# Altium project Printer.PrjPcb (part 1 of 2)
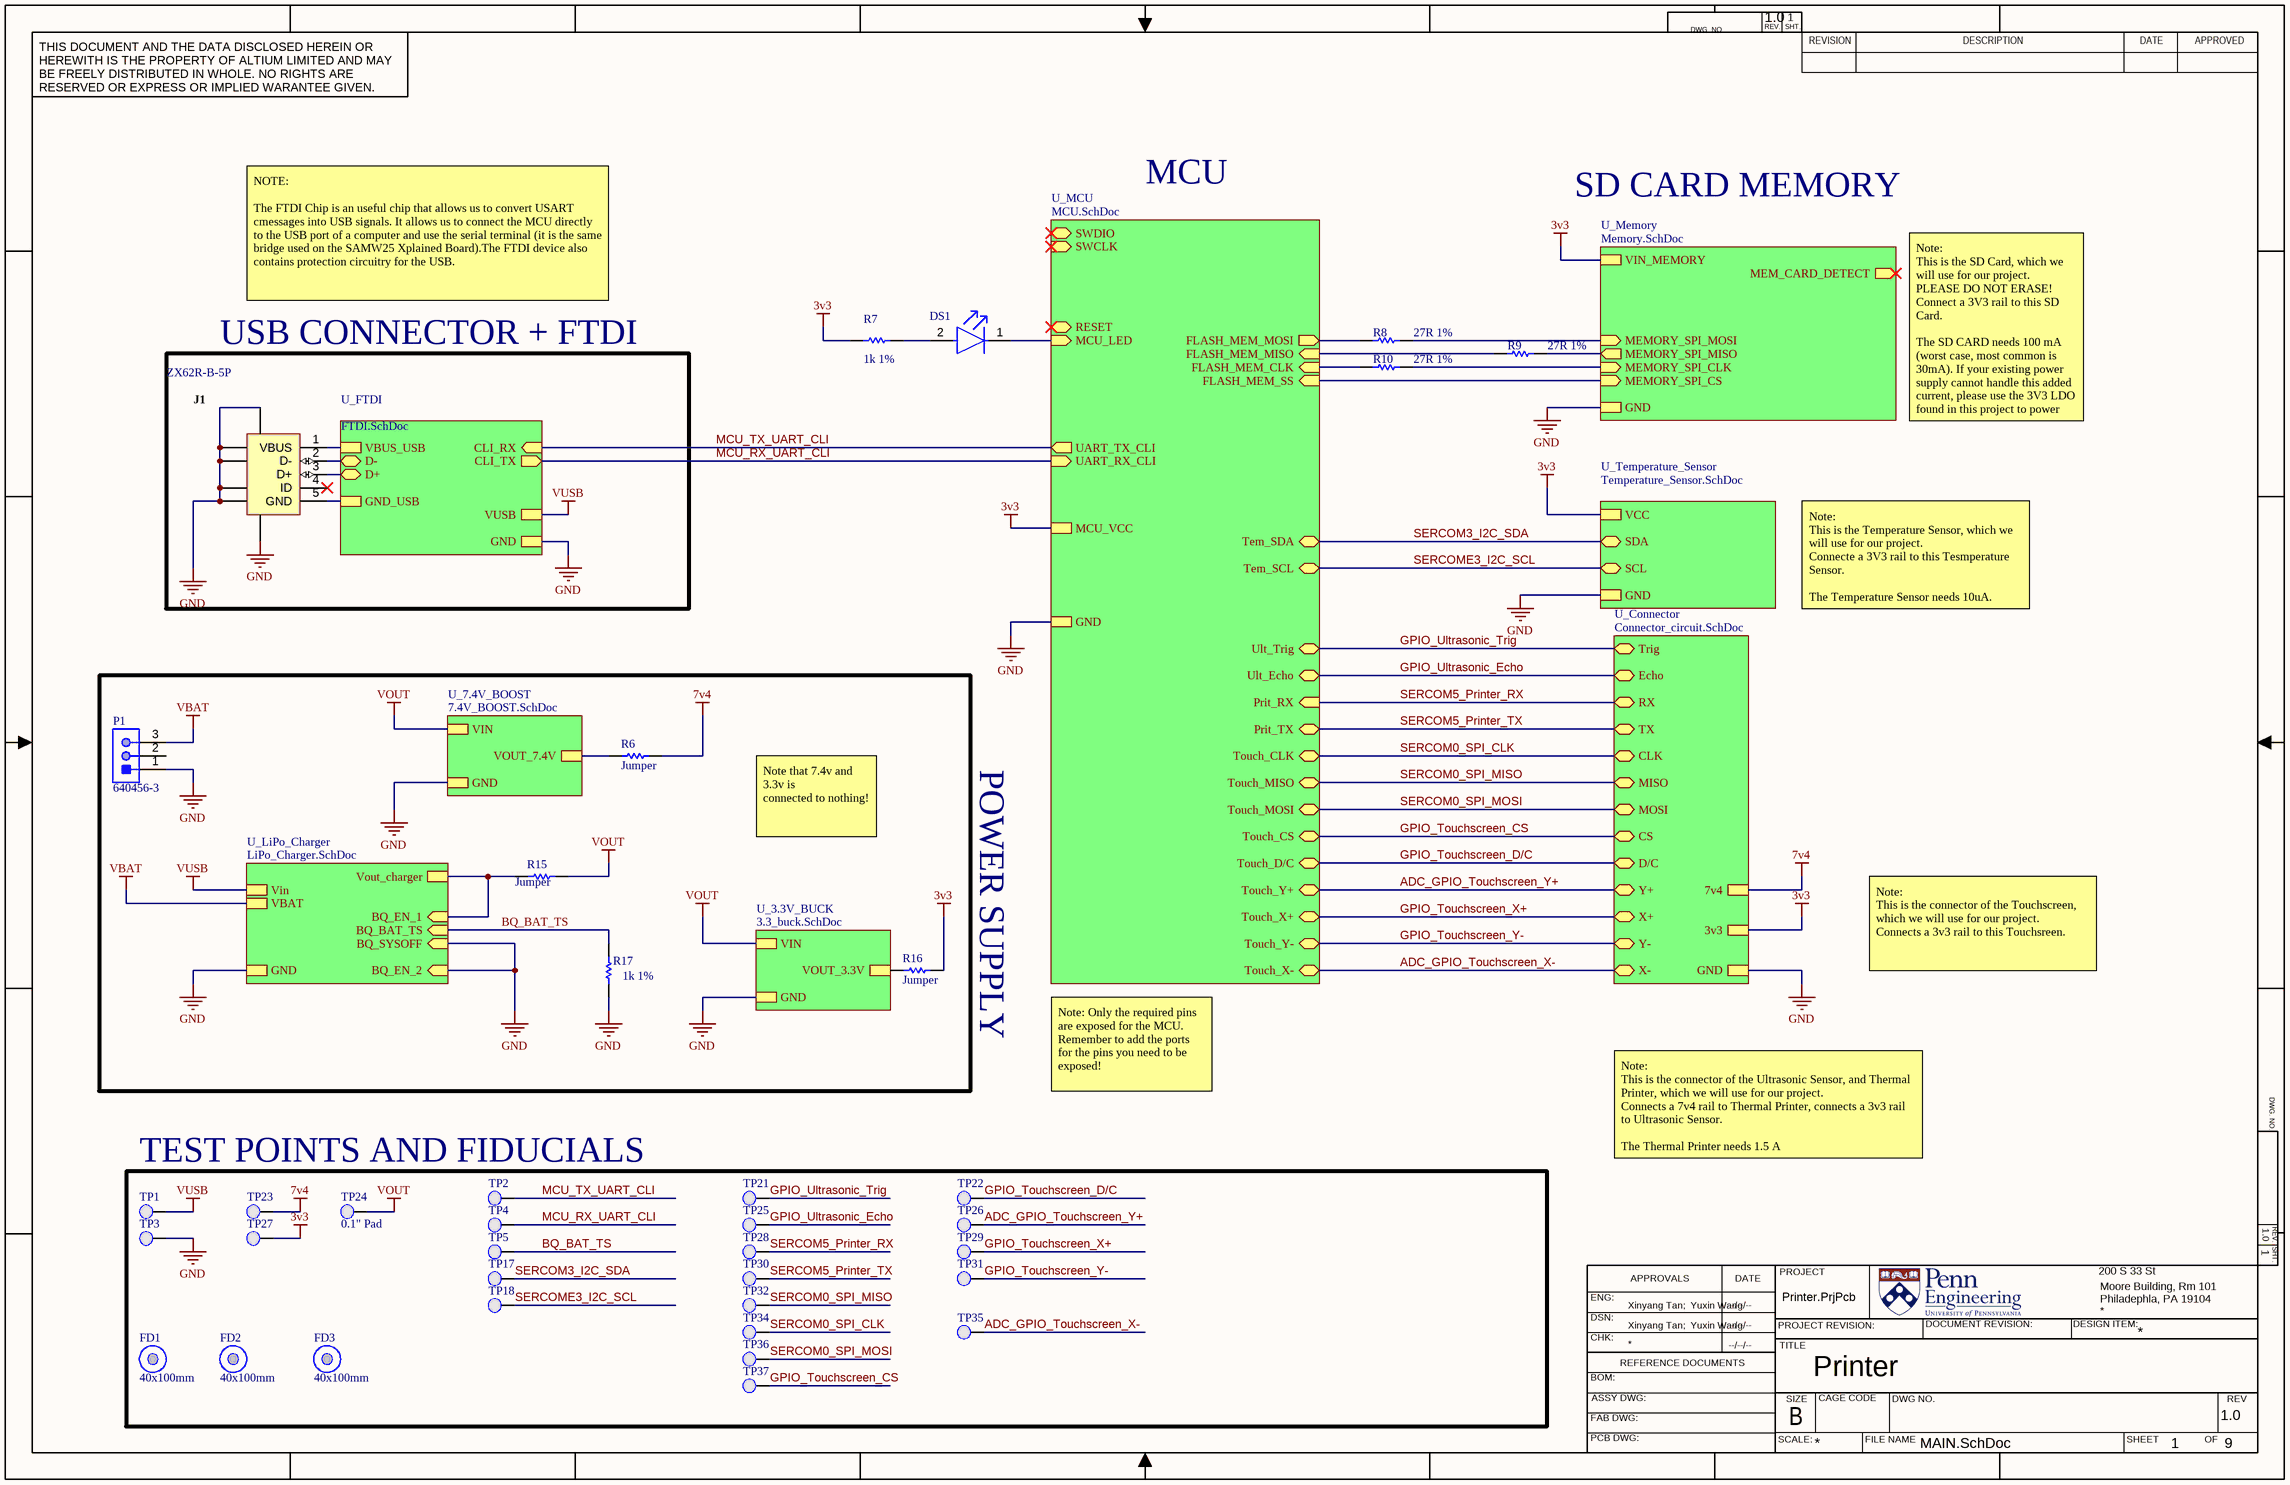
[diagram p0: MAIN.SchDoc]
9 sheets, 151 parts. Net scope: strictly hierarchical (ports join the sheet entries above them; power ports are local).
Board file: Printer.PcbDoc
Sheets:
  MAIN.SchDoc
    U_FTDI = FTDI.SchDoc
    U_MCU = MCU.SchDoc
    U_Memory = Memory.SchDoc
    U_Temperature_Sensor = Temperature_Sensor.SchDoc
    U_Connector = Connector_circuit.SchDoc
    U_LiPo_Charger = LiPo_Charger.SchDoc
    U_7.4V_BOOST = 7.4v_BOOST.schdoc
    U_3.3V_BUCK = 3.3_buck.schdoc

## Sheet MAIN.SchDoc: Printer
size 431 x 279 mm; Date: 2022; Author: Renaissance; CompanyName: Upenn-ESE516; DrawnBy: Xinyang Tan;  Yuxin Wang; Engineer: Xinyang Tan;  Yuxin Wang; Address1: 200 S 33 St; Address2: Moore Building, Rm 101; Address3: Philadephla, PA 19104; DocumentNumber: 1; Revision: 1.0; SheetNumber: 1; SheetTotal: 9; Project: Printer.PrjPcb; ENG_APP_DATE: --/--/--; DSN_APP_DATE: --/--/--; CHK_APP_DATE: --/--/--; Time: 03/02

### Parts
DS1  LTST-C191KGKT  [FP-LTST-C191KGKT-MFG]  (value not drawn)
FD1  40x100mm  [Fiducial_FT]  (no BOM)
FD2  40x100mm  [Fiducial_FT]  (no BOM)
FD3  40x100mm  [Fiducial_FT]  (no BOM)
J1  ZX62R-B-5P  [HIRO-ZX62R-B-5P_V]
P1  640456-3  [TECO-640456-3]
R6  Jumper  [RESC1609X50X30LL10T20]
R7  1k 1%  [RESC1609X50X30NL10T20]
R8  27R 1%  [RESC0603(1608)_N]
R9  27R 1%  [RESC0603(1608)_N]
R10  27R 1%  [RESC0603(1608)_N]
R15  Jumper  [RESC1609X50X30LL10T20]
R16  Jumper  [RESC1609X50X30LL10T20]
R17  1k 1%  [RESC0603(1608)_N]
TP1  0.1" Pad  [PCBComponent]  (value not drawn)
TP2  0.1" Pad  [PCBComponent]  (value not drawn)
TP3  0.1" Pad  [PCBComponent]  (value not drawn)
TP4  0.1" Pad  [PCBComponent]  (value not drawn)
TP5  0.1" Pad  [PCBComponent]  (value not drawn)
TP17  0.1" Pad  [PCBComponent]  (value not drawn)
TP18  0.1" Pad  [PCBComponent]  (value not drawn)
TP21  0.1" Pad  [PCBComponent]  (value not drawn)
TP22  0.1" Pad  [PCBComponent]  (value not drawn)
TP23  0.1" Pad  [PCBComponent]  (value not drawn)
TP24  0.1" Pad  [PCBComponent]
TP25  0.1" Pad  [PCBComponent]  (value not drawn)
TP26  0.1" Pad  [PCBComponent]  (value not drawn)
TP27  0.1" Pad  [PCBComponent]  (value not drawn)
TP28  0.1" Pad  [PCBComponent]  (value not drawn)
TP29  0.1" Pad  [PCBComponent]  (value not drawn)
TP30  0.1" Pad  [PCBComponent]  (value not drawn)
TP31  0.1" Pad  [PCBComponent]  (value not drawn)
TP32  0.1" Pad  [PCBComponent]  (value not drawn)
TP34  0.1" Pad  [PCBComponent]  (value not drawn)
TP35  0.1" Pad  [PCBComponent]  (value not drawn)
TP36  0.1" Pad  [PCBComponent]  (value not drawn)
TP37  0.1" Pad  [PCBComponent]  (value not drawn)

### Blocks framed on the sheet
USB CONNECTOR + FTDI: J1
TEST POINTS AND FIDUCIALS: FD1-FD3 TP1-TP5 TP17 TP18 TP21-TP32 TP34-TP37

### Sub-sheets
U_3.3V_BUCK = 3.3_buck.SchDoc: VIN, GND, VOUT_3.3V
U_7.4V_BOOST = 7.4V_BOOST.SchDoc: VIN, GND, VOUT_7.4V
U_Connector = Connector_circuit.SchDoc: CLK (bidir), MISO (bidir), MOSI (bidir), CS (bidir), D/C (bidir), Y+ (bidir), X+ (bidir), Y- (bidir), X- (bidir), 7v4, 3v3, GND, Trig (bidir), Echo (bidir), RX (bidir), TX (bidir)
U_FTDI = FTDI.SchDoc: CLI_RX (in), CLI_TX (out), VUSB, GND, VBUS_USB, D- (bidir), D+ (bidir), GND_USB
U_LiPo_Charger = LiPo_Charger.SchDoc: Vin, VBAT, GND, Vout_charger, BQ_EN_1 (in), BQ_BAT_TS (in), BQ_SYSOFF (in), BQ_EN_2 (in)
U_MCU = MCU.SchDoc: SWDIO (bidir), SWCLK (in), UART_TX_CLI (out), UART_RX_CLI (in), FLASH_MEM_SS (in), FLASH_MEM_CLK (in), FLASH_MEM_MISO (in), FLASH_MEM_MOSI (out), RESET (bidir), MCU_LED (in), MCU_VCC, GND, Tem_SDA (bidir), Tem_SCL (bidir), Ult_Trig (bidir), Ult_Echo (bidir), Prit_RX (in), Prit_TX (bidir), Touch_CLK (bidir), Touch_MISO (bidir), Touch_MOSI (bidir), Touch_CS (bidir), Touch_D/C (bidir), Touch_Y+ (bidir), Touch_X+ (bidir), Touch_Y- (bidir), Touch_X- (bidir)
U_Memory = Memory.SchDoc: MEMORY_SPI_MOSI (in), MEMORY_SPI_MISO (out), MEMORY_SPI_CLK (in), MEMORY_SPI_CS (in), MEM_CARD_DETECT (out), VIN_MEMORY, GND
U_Temperature_Sensor = Temperature_Sensor.SchDoc: VCC, SDA (bidir), SCL (bidir), GND

### Nets
3v3: R7.1 R16.2 TP27.1(PAD) ; sheet U_MCU/MCU_VCC, sheet U_Memory/VIN_MEMORY, sheet U_Temperature_Sensor/VCC, sheet U_Connector/3v3
7v4: R6.2 TP23.1(PAD) ; sheet U_Connector/7v4
GND: J1.5(GND) J1.6(SHLD) J1.7(SHLD) J1.8(SHLD) J1.9(SHLD) J1.10(SHLD) J1.11(SHLD) P1.1 R17.1 TP3.1(PAD) ; sheet U_FTDI/GND, sheet U_FTDI/GND_USB, sheet U_MCU/GND, sheet U_Memory/GND, sheet U_Temperature_Sensor/GND, sheet U_Connector/GND, sheet U_LiPo_Charger/GND, sheet U_LiPo_Charger/BQ_SYSOFF, sheet U_LiPo_Charger/BQ_EN_2, sheet U_7.4V_BOOST/GND, sheet U_3.3V_BUCK/GND
VBAT: P1.3 ; sheet U_LiPo_Charger/VBAT
VBUS: J1.1(VBUS) ; sheet U_FTDI/VBUS_USB
VOUT: R15.2 TP24.1(PAD) ; sheet U_7.4V_BOOST/VIN, sheet U_3.3V_BUCK/VIN
Vout_BQ: R15.1 ; sheet U_LiPo_Charger/Vout_charger, sheet U_LiPo_Charger/BQ_EN_1
VUSB: TP1.1(PAD) ; sheet U_FTDI/VUSB, sheet U_LiPo_Charger/Vin
ADC_GPIO_Touchscreen_X-: TP35.1(PAD) ; sheet U_MCU/Touch_X-, sheet U_Connector/X-
ADC_GPIO_Touchscreen_Y+: TP26.1(PAD) ; sheet U_MCU/Touch_Y+, sheet U_Connector/Y+
BQ_BAT_TS: R17.2 TP5.1(PAD) ; sheet U_LiPo_Charger/BQ_BAT_TS
FLASH_MEM_SPI_SS: sheet U_MCU/FLASH_MEM_SS, sheet U_Memory/MEMORY_SPI_CS
GPIO_Touchscreen_CS: TP37.1(PAD) ; sheet U_MCU/Touch_CS, sheet U_Connector/CS
GPIO_Touchscreen_D/C: TP22.1(PAD) ; sheet U_MCU/Touch_D/C, sheet U_Connector/D/C
GPIO_Touchscreen_X+: TP29.1(PAD) ; sheet U_MCU/Touch_X+, sheet U_Connector/X+
GPIO_Touchscreen_Y-: TP31.1(PAD) ; sheet U_MCU/Touch_Y-, sheet U_Connector/Y-
GPIO_Ultrasonic_Echo: TP25.1(PAD) ; sheet U_MCU/Ult_Echo, sheet U_Connector/Echo
GPIO_Ultrasonic_Trig: TP21.1(PAD) ; sheet U_MCU/Ult_Trig, sheet U_Connector/Trig
MCU_LED: DS1.1(C) ; sheet U_MCU/MCU_LED
MCU_RX_UART_CLI: TP4.1(PAD) ; sheet U_FTDI/CLI_TX, sheet U_MCU/UART_RX_CLI
MCU_TX_UART_CLI: TP2.1(PAD) ; sheet U_FTDI/CLI_RX, sheet U_MCU/UART_TX_CLI
MEM_SPI_CLK: R10.2 ; sheet U_Memory/MEMORY_SPI_CLK
MEM_SPI_MISO: R9.2 ; sheet U_Memory/MEMORY_SPI_MISO
MEM_SPI_MOSI: R8.2 ; sheet U_Memory/MEMORY_SPI_MOSI
SERCOM0_SPI_CLK: TP34.1(PAD) ; sheet U_MCU/Touch_CLK, sheet U_Connector/CLK
SERCOM0_SPI_MISO: TP32.1(PAD) ; sheet U_MCU/Touch_MISO, sheet U_Connector/MISO
SERCOM0_SPI_MOSI: TP36.1(PAD) ; sheet U_MCU/Touch_MOSI, sheet U_Connector/MOSI
SERCOM1_PAD2_SPI_MISO: R9.1 ; sheet U_MCU/FLASH_MEM_MISO
SERCOM1_PAD2_SPI_MOSI: R8.1 ; sheet U_MCU/FLASH_MEM_MOSI
SERCOM1_PAD3_SPI_SCK: R10.1 ; sheet U_MCU/FLASH_MEM_CLK
SERCOM3_I2C_SDA: TP17.1(PAD) ; sheet U_MCU/Tem_SDA, sheet U_Temperature_Sensor/SDA
SERCOM5_Printer_RX: TP28.1(PAD) ; sheet U_MCU/Prit_RX, sheet U_Connector/RX
SERCOM5_Printer_TX: TP30.1(PAD) ; sheet U_MCU/Prit_TX, sheet U_Connector/TX
SERCOME3_I2C_SCL: TP18.1(PAD) ; sheet U_MCU/Tem_SCL, sheet U_Temperature_Sensor/SCL
USB_DATA_N: J1.2(D-) ; sheet U_FTDI/D-
USB_DATA_P: J1.3(D+) ; sheet U_FTDI/D+
VOUT_3.3V: R16.1 ; sheet U_3.3V_BUCK/VOUT_3.3V
VOUT_7.4V: R6.1 ; sheet U_7.4V_BOOST/VOUT_7.4V
NetDS1_2: DS1.2(A) R7.2

Not connected (* = marked no-connect by the designer): J1 4(ID)*; P1 2

### Notes on the sheet
- MCU
- SD CARD MEMORY
- NOTE:
  The FTDI Chip is an useful chip that allows us to convert USART cmessages into USB signals. It allows us to connect the MCU directly to the USB port of a computer and use the serial terminal (it is the same bridge used on the SAMW25 Xplained Board).The FTDI device also contains protection circuitry for the USB.
- Note:
  This is the SD Card, which we will use for our project. PLEASE DO NOT ERASE! Connect a 3V3 rail to this SD Card.
  The SD CARD needs 100 mA (worst case, most common is 30mA). If your existing power supply cannot handle this added current, please use the 3V3 LDO found in this project to power your SD Card.
- Note:
  This is the Temperature Sensor, which we will use for our project.
  Connecte a 3V3 rail to this Tesmperature Sensor.
  The Temperature Sensor needs 10uA.
- (near R16) POWER SUPPLY
- Note that 7.4v and 3.3v is
  connected to nothing!
- Note:
  This is the connector of the Touchscreen, which we will use for our project.
  Connects a 3v3 rail to this Touchsreen.
- Note: Only the required pins are exposed for the MCU. Remember to add the ports for the pins you need to be exposed!
- Note:
  This is the connector of the Ultrasonic Sensor, and Thermal Printer, which we will use for our project.
  Connects a 7v4 rail to Thermal Printer, connects a 3v3 rail to Ultrasonic Sensor.
  The Thermal Printer needs 1.5 A
- DWG. NO.
- REV.
- SHT.
- THIS DOCUMENT AND THE DATA DISCLOSED HEREIN OR HEREWITH IS THE PROPERTY OF ALTIUM LIMITED AND MAY BE FREELY DISTRIBUTED IN WHOLE. NO RIGHTS ARE RESERVED OR EXPRESS OR IMPLIED WARANTEE GIVEN.
- REVISION
- DESCRIPTION
- DATE
- APPROVED
- ENG:
- APPROVALS
- PROJECT
- DSN:
- CHK:
- REFERENCE DOCUMENTS
- PROJECT REVISION:
- TITLE
- DOCUMENT REVISION:
- DESIGN ITEM:
- BOM:
- FAB DWG:
- PCB DWG:
- ASSY DWG:
- SCALE:
- SIZE
- B
- CAGE CODE
- FILE NAME
- DWG NO.
- SHEET
- OF
- REV

### Library data of the parts
DS1 = CMP-2000-05198-2: LED GREEN CLEAR SMD; Forward Voltage: 2V; Number of Elements: 1; Viewing Angle: 130°; Forward Current: 30mA; Luminous Intensity: 35mcd; Reverse Voltage: 5V; Power Dissipation: 75mW; Lens Color: Colorless; Dominant Wavelength: 571nm; Lens Style: Rectangular; Test Current: 20mA; Wavelength: 574nm; Packaging: Tape and Reel; Width: 0.8mm; Case Code (Imperial): 0603; Number of Pins: 2; Max Power Dissipation: 75mW; Lead Free: Lead Free; Package Quantity: 1; Min Operating Temperature: -55°C; Case/Package: 0603; Length: 1.6mm; Depth: 0.8mm; Radiation Hardening: No; Mount: Surface Mount; Max Operating Temperature: 85°C; Color: Green; Power Rating: 75mW; Height: 0.55mm; Number of LEDs: 1; Illumination Color: Green; Case Code (Metric): 1608; Lens Transparency: Clear
FD1-FD3 = CMP-00174-A.4: Fiducial 40x100mm
J1 = CMP-0031-00001-1: Connector; USBMicro-B,Reverse type, SMT; 5 Position; Right Angle; DatasheetVersion: 08/2010; Operating Temperature: -30 to 85 degC; Mounting Technology: Surface Mount; PartNumber: ZX62R-B-5P; PackageReference: ZX62R-B-5P; ComponentLink2URL: http://www.hirose.co.jp/cataloge_hp/e24200011.pdf; ComponentLink1URL: http://www.hirose.com/â€Ž; ComponentLink2Description: Datasheet; PackageDescription: 5-Pin USB Micro-B R/A Connector; ComponentLink1Description: Manufacturer URL
P1 = CMP-2000-05418-1: Male Header, Pitch 2.54 mm, 1 x 3 Position, Height 10.03 mm, Tail Length 3.56 mm, -55 to 105 degC; Manufacturer: TE Connectivity; Agency Approvals: CSA,UL; Angle: Straight; Number of Positions: 3; Standards: RoHSCompliant,ELVCompliant,UL94V-0; Current, Rating: 5 / A; Connector Type: MTA-100; Mount Angle: Vertical; Material, Housing: Polyester; Temperature, Operating: -55to+105 / degC; Voltage, Rating: 250 / V; Color, Housing: White; Contact Centerline Spacing: 0.100 / in.; Special Features: Pinstrip; Material, Contact: CopperAlloy; Contact Termination Area Plating: Tin; Primary Type: InterconnectSystem; Pin Spacing: 0.1 / "; Brand/Series: MTA-100Series; Mounting Hole Size: 0.04 / "; Manufacturer URL: http://www.te.com/; Datasheet URL: https://datasheet.ciiva.com/16456/eng-ds-82056-mta-0608-16456886.pdf; Flammability Rating: UL94V-0; Mounting Type: PCMount; Contact Mating Area Plating: Tin; Datasheet Version: Jun-08; Number of Rows: 1; Termination: Solder; Type: PCBPlug; Length, Pin: 0.14 / "; Color: White; Contact Plating: Tin; Contact Shape: Square; Number of Contacts: 3; Size, Post: 0.025 / in.; Length, Terminal Post: 0.14 / in.; Length, Overall: 0.3 / "
R6 R15 R16 = CMP-1012-00001-2: Manufacturer: Vishay Dale; Part Number: CRCW06030000Z0EC
R7 = CMP-1012-00510-2: Manufacturer: Vishay Dale; Part Number: CRCW06031K00FKEB
R8-R10 = CMP-1012-00331-1: 27R 0.1W 1% 0603 (1608 Metric)  SMD; Case-EIA: 0603; Value: 27.00 Ohm; Case-Metric: 1608; Technology: SMT; Tolerance: 1 %; Power: 0.1 W
R17 = CMP-1012-00001-1: Jumper 0603 (1608 Metric); Case-Metric: 1608; Value: 0.00 Ohm; Power: None; Case-EIA: 0603; Technology: SMT; Tolerance: None
TP1-TP5 TP17 TP18 TP21-TP32 TP34-TP37 = 0.1" Pad-A.4

## Sheet FTDI.SchDoc: Printer
size 431 x 279 mm; Date: 2022; Author: Renaissance; CompanyName: Upenn-ESE516; DrawnBy: Xinyang Tan;  Yuxin Wang; Engineer: Xinyang Tan;  Yuxin Wang; Address1: 200 S 33 St; Address2: Moore Building, Rm 101; Address3: Philadephla, PA 19104; DocumentNumber: 2; Revision: 1.0; SheetNumber: 2; SheetTotal: 9; Time: 03/02
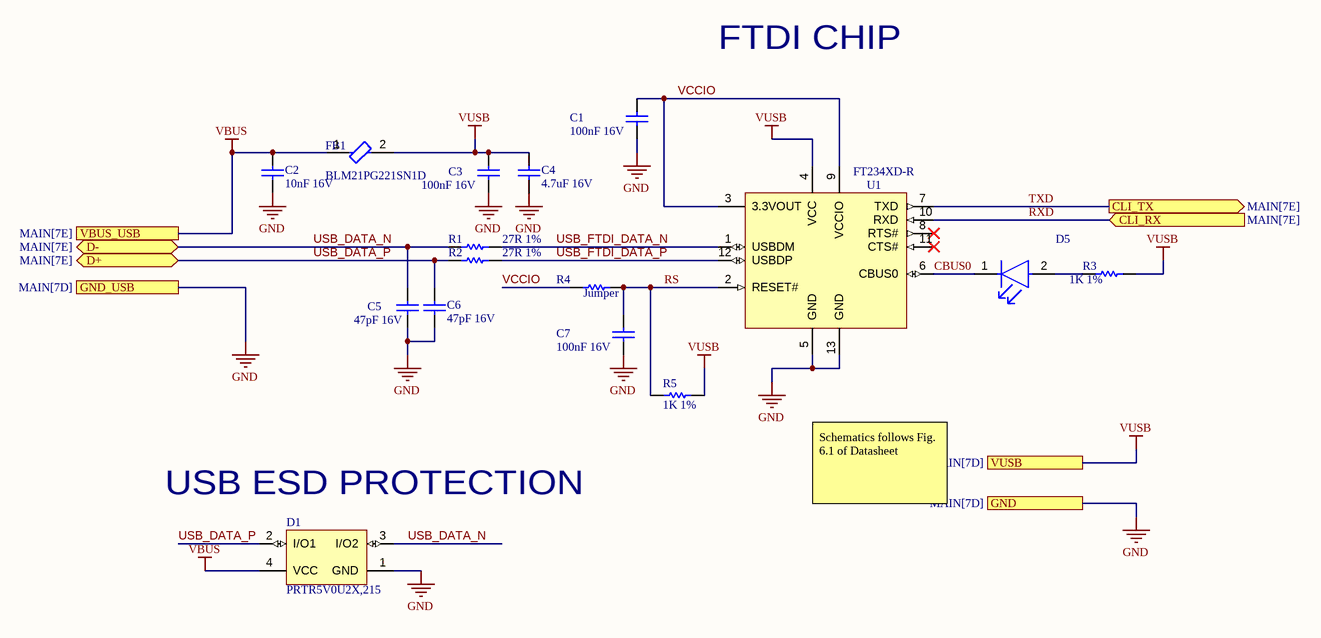
[diagram p1: FTDI.SchDoc]

### Parts
C1  100nF 16V  [CAPC1608X95X40NL15T15]
C2  10nF 16V  [CAPC1608X87X35ML15T15]
C3  100nF 16V  [CAPC1608X95X40NL15T15]
C4  4.7uF 16V  [CAPC0805(2012)145_N]
C5  47pF 16V  [CAPC0603(1608)100_N]
C6  47pF 16V  [CAPC0603(1608)100_N]
C7  100nF 16V  [CAPC1608X95X40NL15T15]
D1  PRTR5V0U2X,215  [NXP-SOT143B-4_V]
D5  LTST-C170CKT  [FP-LTST-C170CKT-MFG]  (value not drawn)
FB1  BLM21PG221SN1D  [FP-BLM21-0_2-t0_85-e0_5-IPC_B]
R1  27R 1%  [RESC0603(1608)_N]
R2  27R 1%  [RESC0603(1608)_N]
R3  1K 1%  [RESC1609X50X30NL10T20]
R4  Jumper  [RESC1609X50X30LL10T20]
R5  1K 1%  [RESC1609X50X30NL10T20]
U1  FT234XD-R  [DFN-12_V]

### Ports
CLI_RX (in, see MAIN[7E]), CLI_TX (out, see MAIN[7E]), D+ (bidir, see MAIN[7E]), D- (bidir, see MAIN[7E]), GND (see MAIN[7D]), GND_USB (see MAIN[7D]), VBUS_USB (see MAIN[7E]), VUSB (see MAIN[7D])

### Nets
GND: C1.1 C2.1 C3.1 C4.1 C5.1 C6.1 C7.1 D1.1(GND) U1.5(GND) U1.13(GND) ; port GND, port GND_USB
VBUS: C2.2 D1.4(VCC) FB1.1 ; port VBUS_USB
VUSB: C3.2 C4.2 FB1.2 R3.2 R5.1 U1.4(VCC) ; port VUSB
CBUS0: D5.1(C) U1.6(CBUS0)  [project net CBUS0_2]
RS: C7.2 R4.2 R5.2 U1.2(RESET#)  [project net RS_2]
RXD: U1.10(RXD) ; port CLI_RX  [project net MCU_TX_UART_CLI]
TXD: U1.7(TXD) ; port CLI_TX  [project net MCU_RX_UART_CLI]
USB_DATA_N: C5.2 D1.3(I/O2) R1.1 ; port D-
USB_DATA_P: C6.2 D1.2(I/O1) R2.1 ; port D+
USB_FTDI_DATA_N: R1.2 U1.1(USBDM)  [project net USB_FTDI_DATA_N_2]
USB_FTDI_DATA_P: R2.2 U1.12(USBDP)  [project net USB_FTDI_DATA_P_2]
VCCIO: C1.2 R4.1 U1.3(3.3VOUT) U1.9(VCCIO)  [project net VCCIO_2]
NetD5_2: D5.2(A) R3.1

Not connected (* = marked no-connect by the designer): U1 8(RTS#)* 11(CTS#)*

### Notes on the sheet
- FTDI CHIP
- (near D1) USB ESD PROTECTION
- Schematics follows Fig. 6.1 of Datasheet
- DWG. NO.
- REV.
- SHT.
- THIS DOCUMENT AND THE DATA DISCLOSED HEREIN OR HEREWITH IS THE PROPERTY OF ALTIUM LIMITED AND MAY BE FREELY DISTRIBUTED IN WHOLE. NO RIGHTS ARE RESERVED OR EXPRESS OR IMPLIED WARANTEE GIVEN.
- REVISION
- DESCRIPTION
- DATE
- APPROVED
- ENG:
- APPROVALS
- PROJECT
- DSN:
- CHK:
- REFERENCE DOCUMENTS
- PROJECT REVISION:
- TITLE
- DOCUMENT REVISION:
- DESIGN ITEM:
- BOM:
- FAB DWG:
- PCB DWG:
- ASSY DWG:
- SCALE:
- SIZE
- B
- CAGE CODE
- FILE NAME
- DWG NO.
- SHEET
- OF
- REV

### Library data of the parts
C1 C3 C7 = CMP-1035-02584-2: Manufacturer: Vitramon; Part Number: VJ0603Y104KXJCW1BC
C2 = CMP-1035-02311-2: Part Number: C0603C103K4RACTU; Manufacturer: Kemet
C4 = CMP-1036-04893-1: CAP 4.7uF 16V -20% to +80% 0805 (2012 Metric) Thickness 1.45mm SMD; Case-Metric: 2012; Case-EIA: 0805; Max Thickness: 1.45 mm; Value: 4.7uF; Rated Voltage: 16 V; Tolerance: -20% to +80%; Technology: SMT
C5 C6 = CMP-1035-01048-1: CAP 47pF 16V ±0.5pF 0603 (1608 Metric) Thickness 1mm SMD; Case-EIA: 0603; Case-Metric: 1608; Tolerance: Â±0.5pF; Technology: SMT; Value: 47pF; Rated Voltage: 16 V; Max Thickness: 1 mm
D1 = CMP-2000-05285-1: Ultra Low Capacitance Double Rail-to-Rail ESD Protection Diode, 5.5 V, 1 pF, -40 to 85 degC, 4-Pin SOT143B, RoHS, Tape and Reel; Manufacturer: NXP Semiconductors; Capacitance Value: 16pF; Number of Elements: 1; Rad Hardened: No; Reverse Breakdown Voltage: 6V; Working Voltage (Max): 5.5V; Polarity: Uni-Directional; Configuration: Quad; Leakage Current: 0.1uA; Product Height (mm): 1mm; Suppressor Type: DiodeArrays; Product Length (mm): 3mm; Product Depth (mm): 1.4mm; ESD Protection Voltage: 8KV@ContactDisc; Package Type: SOT; Mounting: SurfaceMount; Packaging: TapeandReel; Datasheet Version: Rev. 02, 01/2008; Reverse Stand-off Voltage: 5.5V; Manufacturer URL: http://www.nxp.com/; Operating Temp Range: -40Cto85C; Operating Temperature Classification: Industrial; Working Voltage: 5.5V; Operating Temperature Min Deg. C: -40C; Datasheet URL: https://datasheet.ciiva.com/4479/prtr5v0u2x-102853-4479461.pdf; Leakage Current (Max): 0.1uA; Direction Type: Uni-Directional; Pin Count: 3+Tab; Operating Temperature Max Deg. C: 85C; Mounting Style: SurfaceMount; Package / Case: SOT
D5 = CMP-1674-00001-6: LED RED CLEAR SMD; Number of Elements: 1; Power Dissipation: 100mW; Lens Color: Colorless; Voltage: 5V; Wavelength: 660nm; Viewing Angle: 130°; Forward Current: 40mA; Luminous Intensity: 10mcd; Forward Voltage: 1.8V; Test Current: 10mA; Dominant Wavelength: 638nm; Lens Style: Diffused; Package Quantity: 1; Packaging: Tape and Reel; Max Operating Temperature: 85°C; Min Operating Temperature: -55°C; Mount: Surface Mount; Length: 2mm; Height: 1.1mm; Case/Package: 0805; Radiation Hardening: No; Illumination Color: Red; Max Power Dissipation: 100mW; Reverse Voltage: 5V; Lead Free: Lead Free; Color: Red; Case Code (Imperial): 0805; Case Code (Metric): 2012; Power Rating: 100mW; Lens Transparency: Clear; Number of LEDs: 1; Number of Pins: 2; Depth: 1.25mm; Width: 1.25mm
FB1 = CMP-0686-00610-3: Chip Ferrite Bead, 0805, 220Ω @ 100MHz, 0.045Ω, 25%, 2A; Number of Circuits: 1; Shielding: Unshielded; DC Resistance (DCR): 45mR; Impedance: 220R; Radiation Hardening: No; Material: Ferrite; Frequency: 100MHz; Width: 1.25mm; DC Current: 2A; Max DC Current: 2A; Number of Lines: 1; Package Quantity: 1; Case Code (Metric): 2012; Current Rating: 2A; Case/Package: 0805; Current: 2A; Military Standard: Not; Core Material: Ferrite; Depth: 1.25mm; Contact Plating: Tin; DC Resistance-Max: 45mR; Max Operating Temperature: 125°C; Length: 2mm; Max Current Rating: 2A; REACH SVHC: No SVHC; Termination: SMD/SMT; Min Operating Temperature: -55°C; Series: BLM21P; Test Frequency: 100MHz; Tolerance: 25%; Number of Pins: 2; RoHS Compliant: Yes; Height: 0.85mm; Packaging: Tape and Reel; Lead Free: Lead Free; Case Code (Imperial): 0805
R1 R2 = CMP-1012-00331-1: as R8 on sheet MAIN; Technology: SMT; Tolerance: 1 %; Power: 0.1 W
R3 R5 = CMP-1012-00510-2: as R7 on sheet MAIN
R4 = CMP-1012-00001-2: as R6 on sheet MAIN
U1 = CMP-0248-00027-1: FT234XD USB to BASIC UART IC, -40 to +85 degC, 12-Pin DFN, Pb-Free, Tape and Reel; Manufacturer: FTDI; PackageReference: DFN-12; PackageVersion: Feb-13; DatasheetVersion: ver 1.1, Feb-2013; ComponentLink1URL: http://www.ftdichip.com/; PartNumber: FT234XD-R; ComponentLink2URL: http://www.ftdichip.com/Support/Documents/DataSheets/ICs/DS_FT234XD.pdf; ComponentLink1Description: Manufacturer URL; PackageDescription: 12-Pin Dual Flat No-Lead, 3 x 3 mm Body, 0.45 mm Pitch, Exposed Pad; ComponentLink2Description: Datasheet

## Sheet MCU.SchDoc: Printer
size 431 x 279 mm; Date: 2022; Author: Renaissance; CompanyName: Upenn-ESE516; DrawnBy: Xinyang Tan;  Yuxin Wang; Engineer: Xinyang Tan;  Yuxin Wang; Address1: 200 S 33 St; Address2: Moore Building, Rm 101; Address3: Philadephla, PA 19104; DocumentNumber: 7; Revision: 1.0; SheetNumber: 7; SheetTotal: 9
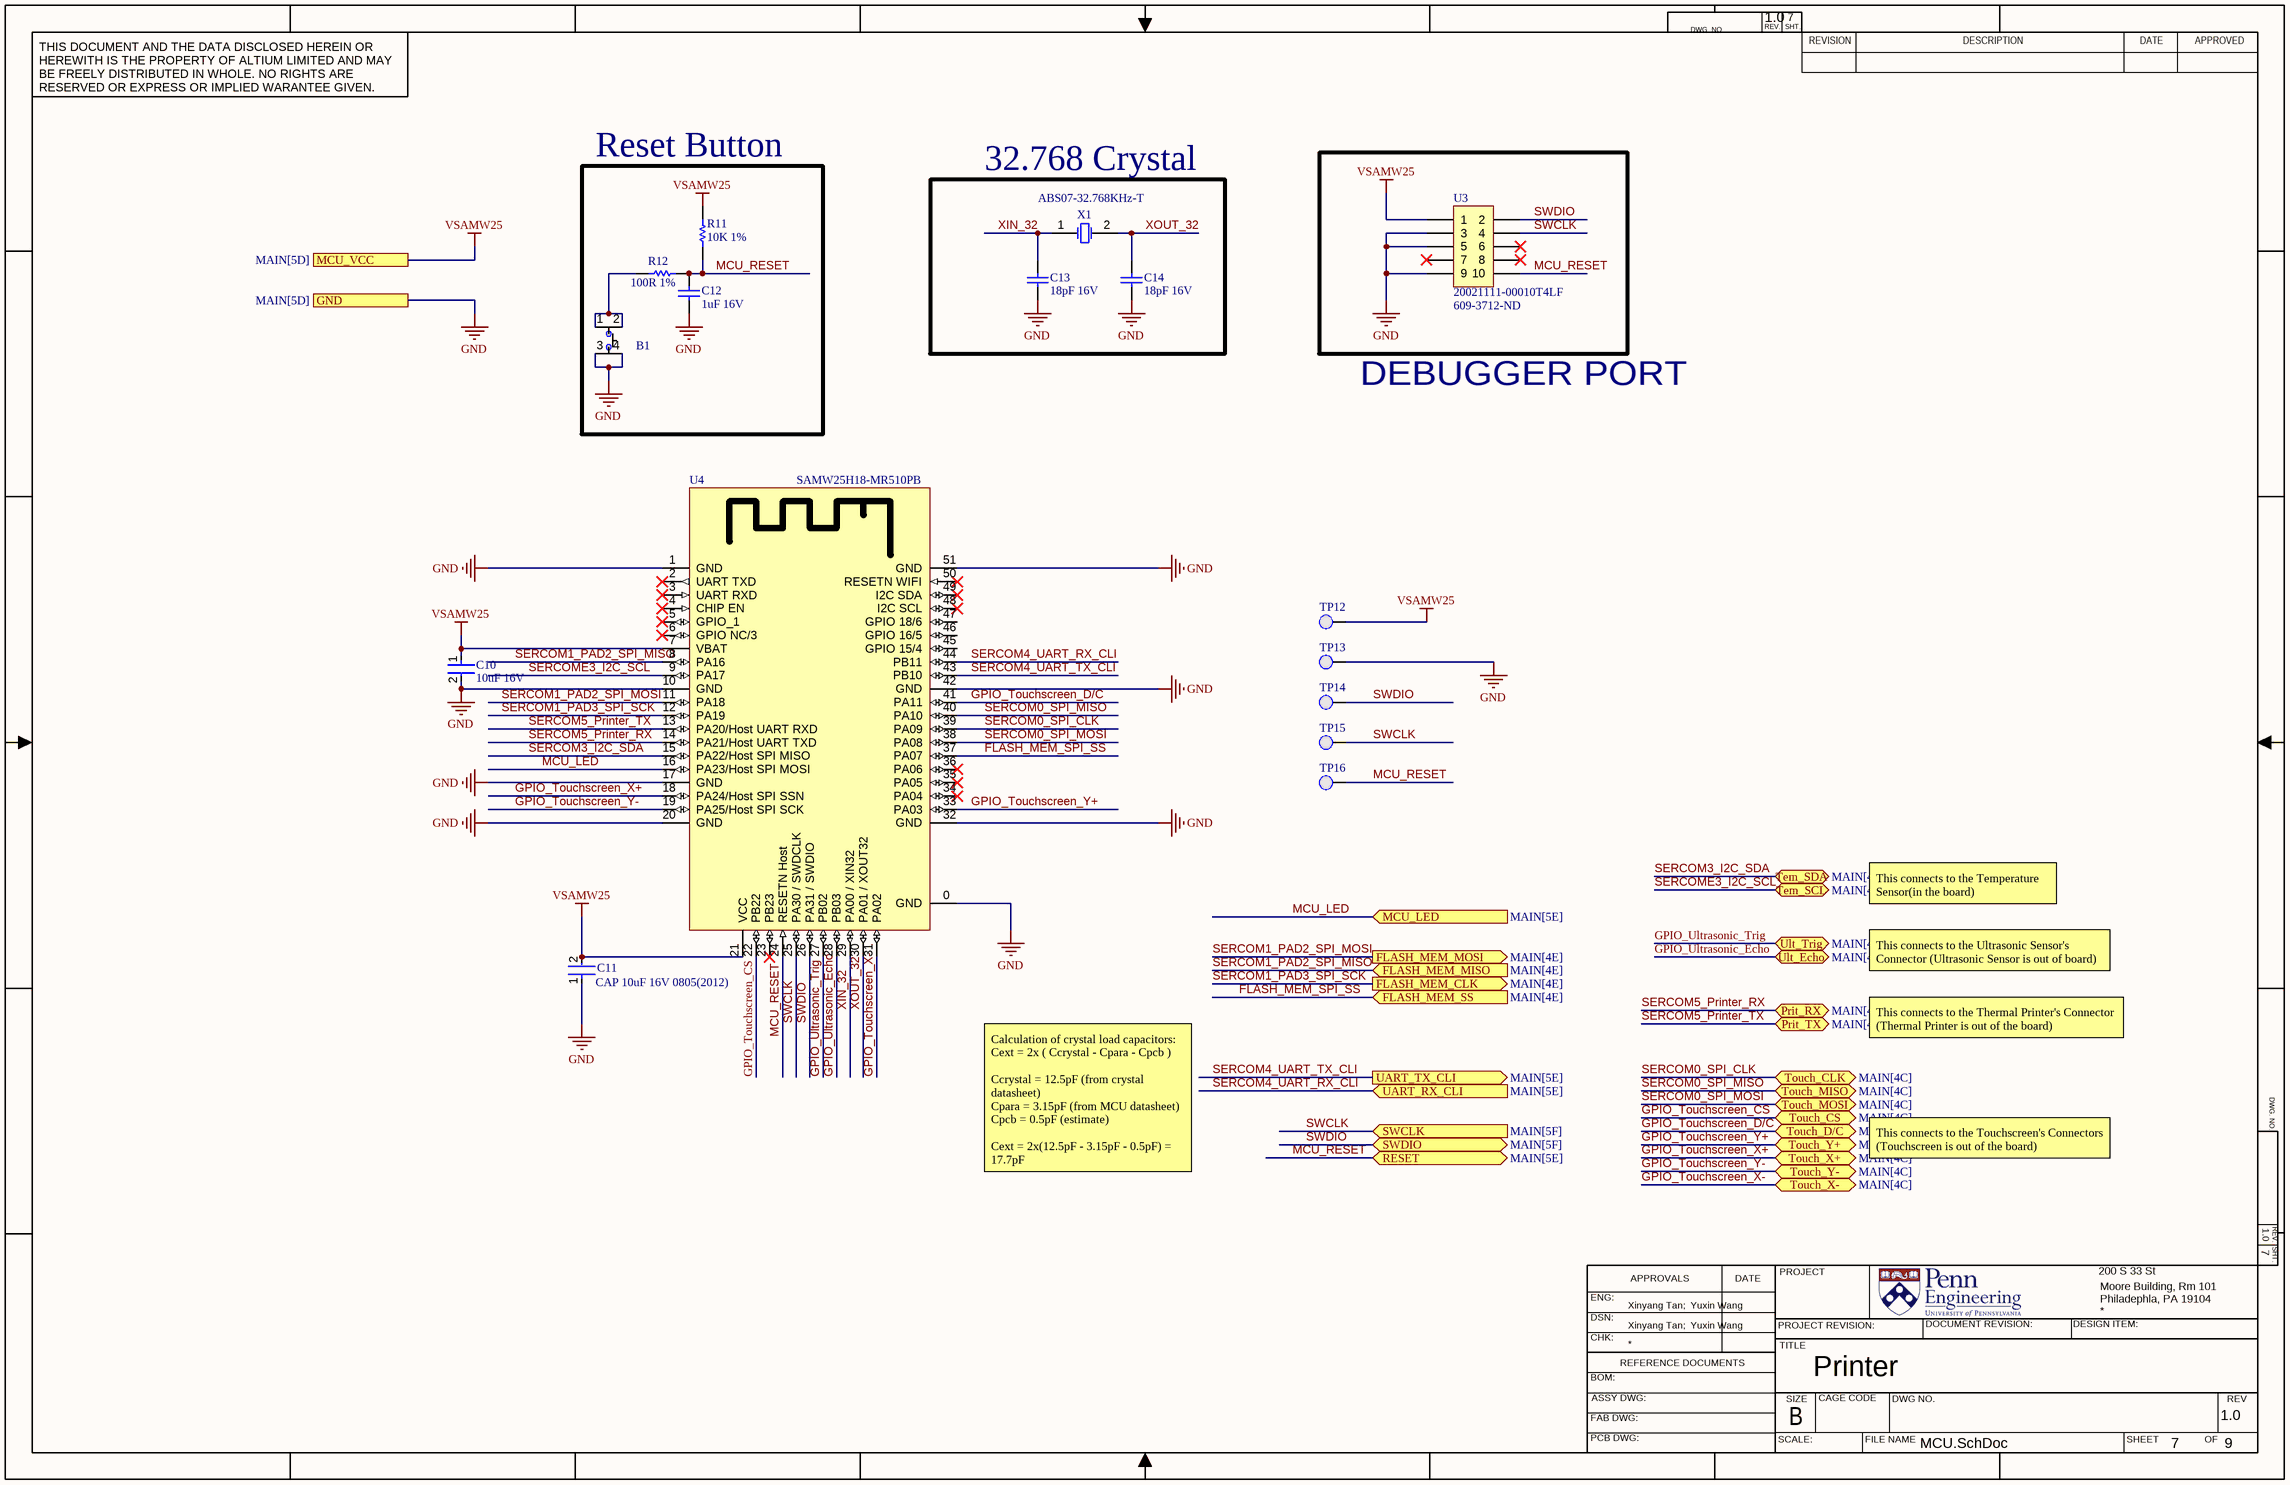
[diagram p2: MCU.SchDoc]

### Parts
B1  PTS810 SJK 250 SMTR LFS  [PTS810 SJK 250 SMTR LFS]  (value not drawn)
C10  10uF 16V  [FP-0805-L_2_01_0_2-W_1_25-IPC_A]
C11  CAP 10uF 16V 0805(2012)  [FP-0805-L_2_01_0_2-W_1_25-IPC_A]
C12  1uF 16V  [CAPC0603(1608)100_N]
C13  18pF 16V  [CAPC0603(1608)100_N]
C14  18pF 16V  [CAPC0603(1608)100_N]
R11  10K 1%  [RESC0603(1608)_N]
R12  100R 1%  [RESC0603(1608)_N]
TP12  0.1" Pad  [PCBComponent]  (value not drawn)
TP13  0.1" Pad  [PCBComponent]  (value not drawn)
TP14  0.1" Pad  [PCBComponent]  (value not drawn)
TP15  0.1" Pad  [PCBComponent]  (value not drawn)
TP16  0.1" Pad  [PCBComponent]  (value not drawn)
U3  20021111-00010T4LF  Supplier Part Number 1: 609-3712-ND  [20021111-00010T4LF]
U4  SAMW25H18-MR510PB  [SAMW25H18-MR510PB]
X1  ABS07-32.768KHz-T  [ABRA-ABS07-2_V]

### Blocks framed on the sheet
Reset Button: B1 C12 R11 R12
32.768 Crystal: C13 C14 X1

### Ports
FLASH_MEM_CLK (out, see MAIN[4E]), FLASH_MEM_MISO (in, see MAIN[4E]), FLASH_MEM_MOSI (out, see MAIN[4E]), FLASH_MEM_SS (in, see MAIN[4E]), GND (see MAIN[5D]), MCU_LED (in, see MAIN[5E]), MCU_VCC (see MAIN[5D]), Prit_RX (bidir, see MAIN[4D]), Prit_TX (bidir, see MAIN[4D]), RESET (bidir, see MAIN[5E]), SWCLK (in, see MAIN[5F]), SWDIO (bidir, see MAIN[5F]), Tem_SCL (bidir, see MAIN[4D]), Tem_SDA (bidir, see MAIN[4D]), Touch_CLK (bidir, see MAIN[4C]), Touch_CS (bidir, see MAIN[4C]), Touch_D/C (bidir, see MAIN[4C]), Touch_MISO (bidir, see MAIN[4C]), Touch_MOSI (bidir, see MAIN[4C]), Touch_X+ (bidir, see MAIN[4C]), Touch_X- (bidir, see MAIN[4C]), Touch_Y+ (bidir, see MAIN[4C]), Touch_Y- (bidir, see MAIN[4C]), UART_RX_CLI (in, see MAIN[5E]), UART_TX_CLI (out, see MAIN[5E]), Ult_Echo (bidir, see MAIN[4D]), Ult_Trig (bidir, see MAIN[4D])

### Nets
GND: B1.3 B1.4 C10.2 C11.1 C12.1 C13.1 C14.1 TP13.1(PAD) U3.3 U3.5 U3.9 U4.0(GND) U4.1(GND) U4.10(GND) U4.17(GND) U4.20(GND) U4.32(GND) U4.42(GND) U4.51(GND) ; port GND
VSAMW25: C10.1 C11.2 R11.2 TP12.1(PAD) U3.1 U4.7(VBAT) U4.21(VCC) ; port MCU_VCC  [project net 3v3]
FLASH_MEM_SPI_SS: U4.37(PA07) ; port FLASH_MEM_SS
GPIO_Touchscreen_CS: U4.22(PB22) ; port Touch_CS
GPIO_Touchscreen_D/C: U4.41(PA11) ; port Touch_D/C
GPIO_Touchscreen_X+: U4.18(PA24/Host_SPI_SSN) ; port Touch_X+
GPIO_Touchscreen_X-: U4.31(PA02) ; port Touch_X-  [project net ADC_GPIO_Touchscreen_X-]
GPIO_Touchscreen_Y+: U4.33(PA03) ; port Touch_Y+  [project net ADC_GPIO_Touchscreen_Y+]
GPIO_Touchscreen_Y-: U4.19(PA25/Host_SPI_SCK) ; port Touch_Y-
GPIO_Ultrasonic_Echo: U4.28(PB03) ; port Ult_Echo
GPIO_Ultrasonic_Trig: U4.27(PB02) ; port Ult_Trig
MCU_LED: U4.16(PA23/Host_SPI_MOSI) ; port MCU_LED
MCU_RESET: C12.2 R11.1 R12.2 TP16.1(PAD) U3.10 U4.24(RESETN_Host) ; port RESET
SERCOM0_SPI_CLK: U4.39(PA09) ; port Touch_CLK
SERCOM0_SPI_MISO: U4.40(PA10) ; port Touch_MISO
SERCOM0_SPI_MOSI: U4.38(PA08) ; port Touch_MOSI
SERCOM1_PAD2_SPI_MISO: U4.8(PA16) ; port FLASH_MEM_MISO
SERCOM1_PAD2_SPI_MOSI: U4.11(PA18) ; port FLASH_MEM_MOSI
SERCOM1_PAD3_SPI_SCK: U4.12(PA19) ; port FLASH_MEM_CLK
SERCOM3_I2C_SDA: U4.15(PA22/Host_SPI_MISO) ; port Tem_SDA
SERCOM4_UART_RX_CLI: U4.44(PB11) ; port UART_RX_CLI  [project net MCU_RX_UART_CLI]
SERCOM4_UART_TX_CLI: U4.43(PB10) ; port UART_TX_CLI  [project net MCU_TX_UART_CLI]
SERCOM5_Printer_RX: U4.14(PA21/Host_UART_TXD) ; port Prit_RX
SERCOM5_Printer_TX: U4.13(PA20/Host_UART_RXD) ; port Prit_TX
SERCOME3_I2C_SCL: U4.9(PA17) ; port Tem_SCL
SWCLK: TP15.1(PAD) U3.4 U4.25(PA30_/_SWDCLK) ; port SWCLK
SWDIO: TP14.1(PAD) U3.2 U4.26(PA31_/_SWDIO) ; port SWDIO
XIN_32: C13.2 U4.29(PA00_/_XIN32) X1.1(X1)  [project net XIN_32_7]
XOUT_32: C14.2 U4.30(PA01_/_XOUT32) X1.2(X2)  [project net XOUT_32_7]
NetB1_1: B1.1 B1.2 R12.1

Not connected (* = marked no-connect by the designer): U3 6* 7* 8*; U4 2(UART_TXD)* 3(UART_RXD)* 4(CHIP_EN)* 5(GPIO_1)* 6(GPIO_NC/3)* 23(PB23)* 34(PA04)* 35(PA05)* 36(PA06)* 45(GPIO_15/4) 46(GPIO_16/5) 47(GPIO_18/6) 48(I2C_SCL)* 49(I2C_SDA)* 50(RESETN_WIFI)*

### Notes on the sheet
- DEBUGGER PORT
- This connects to the Temperature Sensor(in the board)
- This connects to the Ultrasonic Sensor's Connector (Ultrasonic Sensor is out of board)
- This connects to the Thermal Printer's Connector (Thermal Printer is out of the board)
- Calculation of crystal load capacitors:
  Cext = 2x ( Ccrystal - Cpara - Cpcb )
  Ccrystal = 12.5pF (from crystal datasheet)
  Cpara = 3.15pF (from MCU datasheet)
  Cpcb = 0.5pF (estimate)
  Cext = 2x(12.5pF - 3.15pF - 0.5pF) = 17.7pF
- This connects to the Touchscreen's Connectors (Touchscreen is out of the board)
- DWG. NO.
- REV.
- SHT.
- THIS DOCUMENT AND THE DATA DISCLOSED HEREIN OR HEREWITH IS THE PROPERTY OF ALTIUM LIMITED AND MAY BE FREELY DISTRIBUTED IN WHOLE. NO RIGHTS ARE RESERVED OR EXPRESS OR IMPLIED WARANTEE GIVEN.
- REVISION
- DESCRIPTION
- DATE
- APPROVED
- ENG:
- APPROVALS
- PROJECT
- DSN:
- CHK:
- REFERENCE DOCUMENTS
- PROJECT REVISION:
- TITLE
- DOCUMENT REVISION:
- DESIGN ITEM:
- BOM:
- FAB DWG:
- PCB DWG:
- ASSY DWG:
- SCALE:
- SIZE
- B
- CAGE CODE
- FILE NAME
- DWG NO.
- SHEET
- OF
- REV

### Library data of the parts
B1 = PTS810 SJK 250 SMTR LFS: SWITCH TACTILE SPST-NO 0.05A 16V Tactile Switch SPST-NO Top Actuated Surface Mount; Manufacturer: ITT /  C&K Components; Part # Aliases: Y97LT25B5DBFP; Operating Force: 2.6 N; Actuator: Oval; Current Rating: 50 mA; Voltage Rating DC: 16 VDC; Contact Form: SPST; Switch Function: OFF - (ON); Mounting Direction: Straight; Stem Height: 2.5 mm; Brand: C&K Components; Travel: 0.15 mm; Manufacturer Part Number: PTS810SJK250SMTRLFS; Product Category: Tactile Switches; RoHS: Details; Termination Style: J Form Lead; Mounting Style: SMD/SMT; Color: White; Packaging: Reel; Contact Plating: Silver; Operating Temperature Range: - 40 C to + 85 C; Series: PTS810; Factory Pack Quantity: 2900; ComponentLink1URL: https://datasheet.ciiva.com/18514/pts810-4mar13-18514061.pdf; ComponentLink1Description: https://datasheet.ciiva.com/18514/pts810-4mar13-18514061.pdf; ComponentLink2URL: https://datasheet.ciiva.com/18514/pts810-4mar13-18514062.pdf; ComponentLink2Description: https://datasheet.ciiva.com/18514/pts810-4mar13-18514062.pdf; ComponentLink3URL: https://datasheet.ciiva.com/18514/pts810-4mar13-18514063.pdf; ComponentLink3Description: https://datasheet.ciiva.com/18514/pts810-4mar13-18514063.pdf; Supplier 1: Digi-Key; Supplier Part Number 1: CKN10503CT-ND
C10 C11 = CMP-1036-04927-3: General Purpose Ceramic Capacitor, 0805, 10uF, 10%, X5R, 15%, 16V; Tolerance: 10%; Construction: Flat; Height: 1.4mm; Width: 0.049inch; Contact Plating: Tin; RoHS Compliant: Yes; Min Operating Temperature: -55°C; Depth: 1.25mm; Series: -; Voltage Rating: 16V; Termination: SMD/SMT; Case Code (Metric): 2012; Voltage Rating (DC): 16V; Voltage: 16V; Length: 2.01mm; Thickness: 0.055inch; Radiation Hardening: No; Mount: Surface Mount; Dielectric: X5R; Lead Free: Lead Free; Dielectric Material: Ceramic; Capacitance: 10uF; Case/Package: 0805; REACH SVHC: No SVHC; Packaging: Tape and Reel; Max Operating Temperature: 85°C; Package Quantity: 1; Case Code (Imperial): 0805; Number of Pins: 2
C12 = CMP-1035-02736-1: CAP 1uF 16V ±5% 0603 (1608 Metric) Thickness 1mm SMD; Case-Metric: 1608; Case-EIA: 0603; Tolerance: Â±5%; Technology: SMT; Max Thickness: 1 mm; Rated Voltage: 16 V; Value: 1uF
C13 C14 = CMP-1035-00738-1: CAP 18pF 16V ±5% 0603 (1608 Metric) Thickness 1mm SMD; Tolerance: Â±5%; Case-EIA: 0603; Case-Metric: 1608; Max Thickness: 1 mm; Rated Voltage: 16 V; Value: 18pF; Technology: SMT
R11 = CMP-1012-00623-1: 10K 0.1W 1% 0603 (1608 Metric)  SMD; Value: 10000.00 Ohm; Case-EIA: 0603; Case-Metric: 1608; Power: 0.1 W; Tolerance: 1 %; Technology: SMT
R12 = CMP-1012-00397-1: 100R 0.1W 1% 0603 (1608 Metric)  SMD; Value: 100.00 Ohm; Case-EIA: 0603; Case-Metric: 1608; Technology: SMT; Tolerance: 1 %; Power: 0.1 W
TP12-TP16 = 0.1" Pad-A.4
U3 = 20021111-00010T4LF: CONN HEADER 10POS UNSHD VERT T/H; Manufacturer: Amphenol / FCI; Stack Height: 2.5 mm; Number of Positions / Contacts: 10; Brand: FCI; Pitch: 1.27 mm; Mounting Angle: Vertical; Current Rating: 10 A; Mating Post Length: 3.05 mm; Voltage Rating: 125 V; Manufacturer Part Number: 20021111-00010T4LF; Mounting Style: Through Hole; Product Category: Headers & Wire Housings; RoHS: Details; Series: Minitek; Product Type: Headers; Type: Unshrouded; Number of Positions: 10; Number of Rows: 2; Contact Plating: Gold; Housing Material: Plastic; Termination Style: Through Hole; Contact Material: Nickel; Packaging: Tube; Factory Pack Quantity: 93; Termination Post Length: 2.3 mm; ComponentLink1URL: https://datasheet.ciiva.com/1433/1079612-1433267.pdf; ComponentLink1Description: https://datasheet.ciiva.com/1433/1079612-1433267.pdf; ComponentLink2URL: https://datasheet.ciiva.com/409/20021111-409158.pdf; ComponentLink2Description: https://datasheet.ciiva.com/409/20021111-409158.pdf; ComponentLink3URL: https://datasheet.ciiva.com/5131/20021111-5131386.pdf; ComponentLink3Description: https://datasheet.ciiva.com/5131/20021111-5131386.pdf; ComponentLink4URL: https://datasheet.ciiva.com/9465/20021111-9465402.pdf; ComponentLink4Description: https://datasheet.ciiva.com/9465/20021111-9465402.pdf; Supplier 1: Digi-Key
U4 = SAMW25H18-MR510PB: RF TXRX MODULE WIFI TRACE ANT; Manufacturer: Atmel; Manufacturer Part Number: ATSAMW25H18-MR510PB; Protocol: 802.11b/g/n; Frequency: 2.4GHz; Data Rate: 65Mbps; Power - Output: 17dBm; Sensitivity: -95.5dBm; Serial Interfaces: SPI, UART; Antenna Type: Integrated, Trace; Memory Size: 256kB Flash, 32kB SRAM; Voltage - Supply: 2.7 V ~ 4.2 V; Category: RF/IF and RFID; Family: RF Transceiver Modules; Series: Xplained Pro; Packaging: Tray; RF Family/Standard: WiFi; Modulation: -; Current - Receiving: -; Current - Transmitting: -; Mounting Type: Surface Mount; Operating Temperature: -40°C ~ 85°C; Package / Case: Module; ComponentLink1URL: http://www.atmel.com/devices/ATSAMW25.aspx; ComponentLink1Description: http://www.atmel.com/devices/ATSAMW25.aspx; ComponentLink2URL: http://www.farnell.com/datasheets/1965115.pdf; ComponentLink2Description: http://www.farnell.com/datasheets/1965115.pdf; Supplier 1: Digikey; Stock 1: 120; Pricing 1: 1=19.14 (USD); Supplier Part Number 1: ATSAMW25H18-MR510PB-ND
X1 = CMP-0447-00001-2: Crystal, 32.768 kHz, 12.5 pF, -40 to 85 degC, SMD Low Profile 3.2 x 1.5 x 0.9 mm, Tape and Reel; Manufacturer: Abracon; Q Value (Type): 30000; Operation Mode: Flexural Mode (Tuning Fork); Shunt Capacitance (C0): 0.9 to 1.2 pF; Load Capacitance (CL): 12.5 pF; Frequency Tolerance @+25degC: +/- 20 ppm; Drive Level (Type): 0.1 uW; Equivalent Series Resistance (R1): 70 Kohm; Insulation Resistance (Min): 500 Mohm; ComponentLink3URL: http://www.abracon.com/Resonators/ABS07.pdf; PackageDescription: 2-Pin Hand Drawn, Body 3.2x1.5mm, Pitch 2.5mm; Operating Temperature: -40 to 85 degC; ComponentLink2URL: http://www.abracon.com/Resonators/ABS07.pdf; PackageReference: ABS07-2; ComponentLink3Description: Package Specification; ComponentLink1Description: Manufacturer URL; DatasheetVersion: 04.03.13; Mounting Technology: Surface Mount; ComponentLink2Description: Datasheet; ComponentLink1URL: http://www.abracon.com/; PartNumber: ABS07-32.768KHz-T; Packing: Tape and Reel; Frequency: 32.768 kHz

## Sheet Memory.SchDoc: Printer
size 431 x 279 mm; Date: 2022; Author: Renaissance; CompanyName: Upenn-ESE516; DrawnBy: Xinyang Tan;  Yuxin Wang; Engineer: Xinyang Tan;  Yuxin Wang; Address1: 200 S 33 St; Address2: Moore Building, Rm 101; Address3: Philadephla, PA 19104; DocumentNumber: 9; Revision: 1.0; SheetNumber: 9; SheetTotal: 9
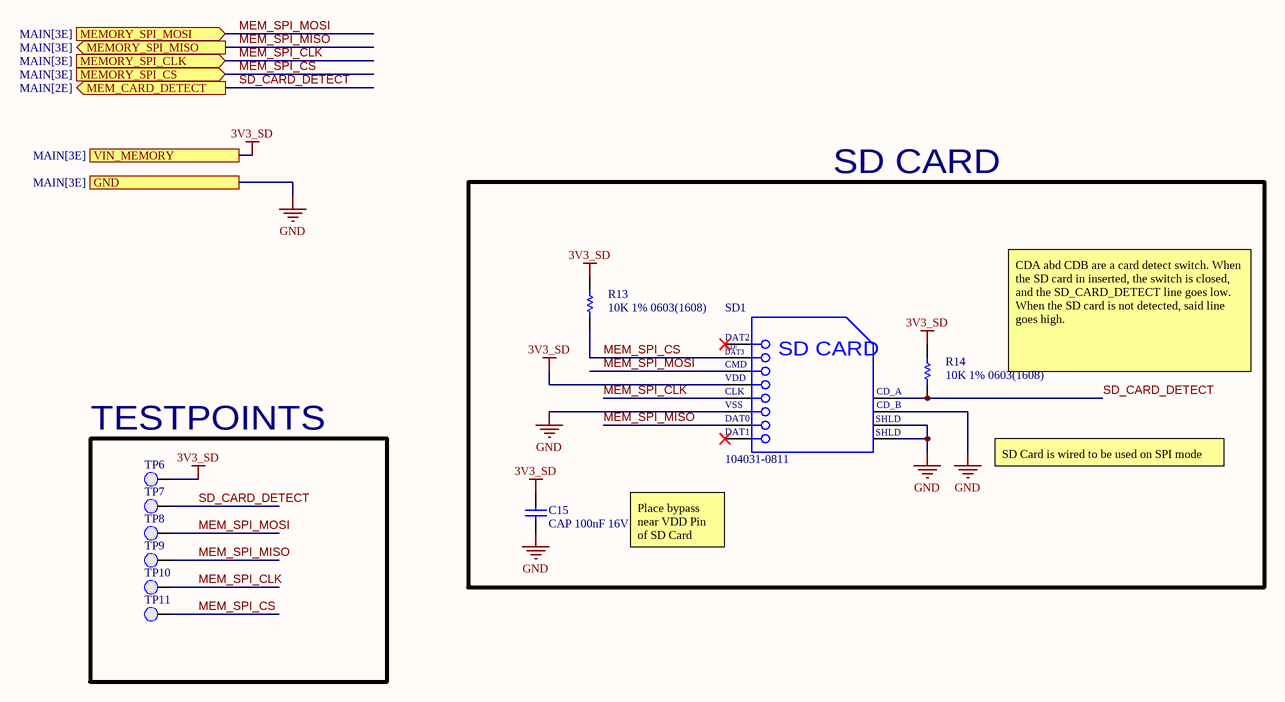
[diagram p3: Memory.SchDoc]

### Parts
C15  CAP 100nF 16V 0603(1608)  [CAPC1608X95X40NL15T15]
R13  10K 1% 0603(1608)  [RESC1609X55X30LL15T15]
R14  10K 1% 0603(1608)  [RESC1609X55X30LL15T15]
SD1  104031-0811  [MOLX-104031-0811_V]
TP6  0.1" Pad  [PCBComponent]  (value not drawn)
TP7  0.1" Pad  [PCBComponent]  (value not drawn)
TP8  0.1" Pad  [PCBComponent]  (value not drawn)
TP9  0.1" Pad  [PCBComponent]  (value not drawn)
TP10  0.1" Pad  [PCBComponent]  (value not drawn)
TP11  0.1" Pad  [PCBComponent]  (value not drawn)

### Blocks framed on the sheet
SD CARD: C15 R13 R14 SD1
TESTPOINTS: TP6-TP11

### Ports
GND (see MAIN[3E]), MEM_CARD_DETECT (out, see MAIN[2E]), MEMORY_SPI_CLK (in, see MAIN[3E]), MEMORY_SPI_CS (in, see MAIN[3E]), MEMORY_SPI_MISO (out, see MAIN[3E]), MEMORY_SPI_MOSI (in, see MAIN[3E]), VIN_MEMORY (see MAIN[3E])

### Nets
3V3_SD: C15.2 R13.2 R14.2 SD1.4(VDD) TP6.1(PAD) ; port VIN_MEMORY  [project net 3v3]
GND: C15.1 SD1.6(VSS2) SD1.10(CD_B) SD1.11(SHLD1) SD1.12(SHLD2) ; port GND
MEM_SPI_CLK: SD1.5(CLK) TP10.1(PAD) ; port MEMORY_SPI_CLK
MEM_SPI_CS: R13.1 SD1.2(CMD) TP11.1(PAD) ; port MEMORY_SPI_CS  [project net FLASH_MEM_SPI_SS]
MEM_SPI_MISO: SD1.7(DAT0) TP9.1(PAD) ; port MEMORY_SPI_MISO
MEM_SPI_MOSI: SD1.3(VSS1) TP8.1(PAD) ; port MEMORY_SPI_MOSI
SD_CARD_DETECT: R14.1 SD1.9(CD_A) TP7.1(PAD) ; port MEM_CARD_DETECT

Not connected (* = marked no-connect by the designer): SD1 1(CD/DAT3)* 8(DAT1)*

### Notes on the sheet
- CDA abd CDB are a card detect switch. When the SD card in inserted, the switch is closed, and the SD_CARD_DETECT line goes low. When the SD card is not detected, said line goes high.
- SD Card is wired to be used on SPI mode
- Place bypass near VDD Pin of SD Card
- DWG. NO.
- REV.
- SHT.
- THIS DOCUMENT AND THE DATA DISCLOSED HEREIN OR HEREWITH IS THE PROPERTY OF ALTIUM LIMITED AND MAY BE FREELY DISTRIBUTED IN WHOLE. NO RIGHTS ARE RESERVED OR EXPRESS OR IMPLIED WARANTEE GIVEN.
- REVISION
- DESCRIPTION
- DATE
- APPROVED
- ENG:
- APPROVALS
- PROJECT
- DSN:
- CHK:
- REFERENCE DOCUMENTS
- PROJECT REVISION:
- TITLE
- DOCUMENT REVISION:
- DESIGN ITEM:
- BOM:
- FAB DWG:
- PCB DWG:
- ASSY DWG:
- SCALE:
- SIZE
- B
- CAGE CODE
- FILE NAME
- DWG NO.
- SHEET
- OF
- REV
- (in symbol CMP-2000-05825-1) DAT2; CD/; DAT3; SD CARD; VSS; SHLD

### Library data of the parts
C15 = CMP-1035-02584-2: as C1 on sheet FTDI
R13 R14 = CMP-1012-00623-3: Chip Resistor, 10 KOhm, +/- 1%, 0.1 W, -55 to 155 degC, 0603 (1608 Metric), RoHS, Tape and Reel; Manufacturer: Panasonic; Voltage Rating: 75V; Case\/Package: 0603; Power Rating: 100mW; Resistance: 10KOhm; Temperature Coefficient: 100ppm\/degreesC; Tolerance: 1%; Number of Pins: 2; Package Reference: 603; Depth: 0.8mm; Mount: SurfaceMount; Package Description: 2-Pin Surface Mount Device, Body 1.6 x 0.85 mm; Datasheet Version: 02/2017; Length: 1.6mm; Lead Free: LeadFree; Height: 0.45mm; Number of Terminations: 2; Max Power Dissipation: 100mW; Min Operating Temperature: -55degC; Datasheet URL: https://industrial.panasonic.com/cdbs/www-data/pdf/RDA0000/AOA0000C304.pdf; Termination: SMD/SMT; Case Code (Metric): 1608; Case Code (Imperial): 0603; Max Operating Temperature: 155degC; RoHSCompliant: true; Voltage Rating (DC): 75V; Radiation Hardening: No; Packaging: TapeandReel; Composition: ThickFilm; Mounting Technology: SurfaceMount; Manufacturer URL: http://www.panasonic.com/; Width: 0.031inch; REACH SVHC: NoSVHC; Contact Plating: Tin; Military Standard: Not; Package Quantity: 1
SD1 = CMP-2000-05825-1: Micro SD Card, RA, -25 to 85 degC, 8-Pin SMD, RoHS, Tape and Reel; Voltage Rating: 10VAC/DC; Number of Contacts: 8; Insertion - Extraction Style: Push-Pull; Pitch: 1.1mm; Mating Cycles: 10000; Brand: Molex; Current Rating: 500mA; Manufacturer URL: http://www.molex.com/; Card Type: microSD; Mounting Type: Standard; Height: 1.42mm; Mounting Technology: SurfaceMount; Contact Plating: Gold; Product Category: MemoryCardConnectors; Package Description: 8-Pin Surface Mount Device, Body 11.95 x 11.4 mm, Pitch 1.1 mm; Datasheet URL: http://www.molex.com/pdm_docs/sd/1040310811_sd.pdf; Termination Style: SMD; Length: 11.4mm; Housing Material: LiquidCrystalPolymer(LCP); Orientation: RightAngle; RoHS: True; Contact Material: PhosphorBronze; Datasheet Version: Rev. E, 04/2006; Packaging: Reel; Manufacturer: Molex; Series: 104031; Product: CardConnectors; Number of Rows: 1Row; Package Reference: 104031-0811
TP6-TP11 = 0.1" Pad-A.4

## Sheet Temperature_Sensor.SchDoc: Printer
size 431 x 279 mm; Date: 2022; Author: Renaissance; CompanyName: Upenn-ESE516; DrawnBy: Xinyang Tan;  Yuxin Wang; Engineer: Xinyang Tan;  Yuxin Wang; Address1: 200 S 33 St; Address2: Moore Building, Rm 101; Address3: Philadephla, PA 19104; DocumentNumber: 8; Revision: 1.0; SheetNumber: 8; SheetTotal: 9
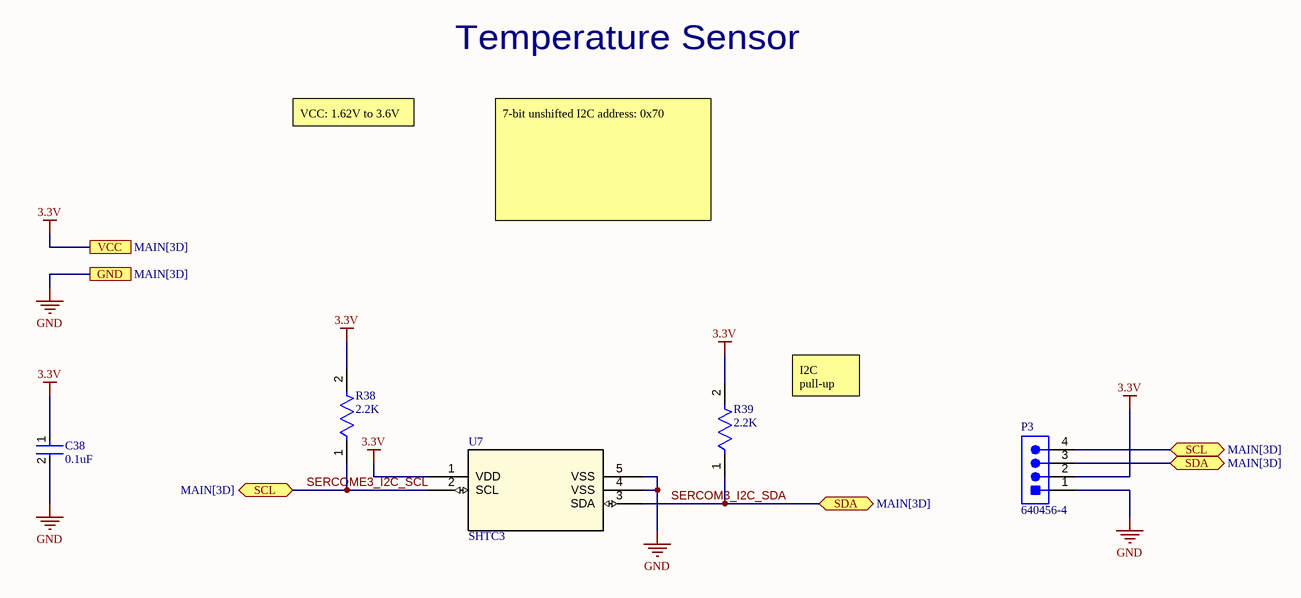
[diagram p4: Temperature_Sensor.SchDoc]

### Parts
C38  0.1uF  [FP-C0402-BB-MFG]
P3  640456-4  [TECO-640456-4]
R38  2.2K  [FP-SR0402-MFG]
R39  2.2K  [FP-SR0402-MFG]
U7  SHTC3  [SHTC3_SEN]

### Ports
GND (see MAIN[3D]), SCL (bidir, see MAIN[3D]), SDA (bidir, see MAIN[3D]), VCC (see MAIN[3D])

### Nets
3.3V: C38.1 P3.2 R38.2 R39.2 U7.1(VDD) ; port VCC  [project net 3v3]
GND: C38.2 P3.1 U7.4(VSS) U7.5(VSS) ; port GND
SERCOM3_I2C_SDA: P3.3 R39.1 U7.3(SDA) ; port SDA
SERCOME3_I2C_SCL: P3.4 R38.1 U7.2(SCL) ; port SCL

### Notes on the sheet
- Temperature Sensor
- VCC: 1.62V to 3.6V
- 7-bit unshifted I2C address: 0x70
- I2C
  pull-up
- DWG. NO.
- REV.
- SHT.
- THIS DOCUMENT AND THE DATA DISCLOSED HEREIN OR HEREWITH IS THE PROPERTY OF ALTIUM LIMITED AND MAY BE FREELY DISTRIBUTED IN WHOLE. NO RIGHTS ARE RESERVED OR EXPRESS OR IMPLIED WARANTEE GIVEN.
- REVISION
- DESCRIPTION
- DATE
- APPROVED
- ENG:
- APPROVALS
- PROJECT
- DSN:
- CHK:
- REFERENCE DOCUMENTS
- PROJECT REVISION:
- TITLE
- DOCUMENT REVISION:
- DESIGN ITEM:
- BOM:
- FAB DWG:
- PCB DWG:
- ASSY DWG:
- SCALE:
- SIZE
- B
- CAGE CODE
- FILE NAME
- DWG NO.
- SHEET
- OF
- REV

### Library data of the parts
C38 = CMP-03020-010956-2: CAP CER 0402 0.1UF 16V X7R 20% A; Manufacturer Part Number: C0402C104M4RACAUTO; Manufacturer: Kemet; Temperature Coefficient: 15%; Tolerance: 0.2; Capacitance: 0.10 μF; Material: Ceramic; Value: 0.10 μF; Octopart: https://octopart.com/c0402c104m4racauto-kemet-75357841; Device Class L3: Ceramic Capacitors; Lead Free: Yes; Package: C0402-BB; Digikey Description: CAP CER 0402 0.1UF 16V X7R 20% A; ComponentLink2Description: Datasheet; Category: Cap; Height: 0.55mm; Device Class L2: Capacitors; Automotive: No; Voltage Rating: 16 V; Device Class L1: Passive Components; Ipc Land Pattern Name: CAPC10050X50; RoHS: TRUE; Temperature Range Low: -55°C; ComponentLink2URL: https://content.kemet.com/datasheets/KEM_C1002_X7R_SMD.pdf; Temperature Characteristic: X7R; Temperature: -55°C to +125°C; Temperature Range High: +125°C
P3 = CMP-2000-05419-1: Male Header, Pitch 2.54 mm, 1 x 4 Position, Height 10.03 mm, Tail Length 3.56 mm, RoHS, Bulk; Manufacturer: TE Connectivity; Material, Housing: Polyester; Primary Type: InterconnectSystem; Mount Angle: Vertical; Color, Housing: White; Current, Rating: 5 / A; Agency Approvals: CSA,UL; Contact Termination Area Plating: Tin; Temperature, Operating: -55to+105 / degC; Standards: RoHSCompliant,ELVCompliant,UL94V-0; Number of Positions: 4; Brand/Series: MTA-100Series; Angle: Straight; Pin Spacing: 0.1 / "; Material, Contact: CopperAlloy; Connector Type: MTA-100; Special Features: Pinstrip; Mounting Hole Size: 0.04 / "; Contact Centerline Spacing: 0.100 / in.; Voltage, Rating: 250 / V; Manufacturer URL: http://www.te.com/; Length, Pin: 0.14 / "; Length, Overall: 0.4 / "; Color: White; Flammability Rating: UL94V-0; Mounting Type: PCMount; Termination: Solder; Datasheet URL: https://datasheet.ciiva.com/16286/eng-ds-82056-mta-0608-16286228.pdf; Number of Contacts: 4; Contact Shape: Square; Contact Mating Area Plating: Tin; Length, Terminal Post: 0.14 / in.; Size, Post: 0.025 / in.; Contact Plating: Tin; Type: PCBPlug; Datasheet Version: Dec-14; Number of Rows: 1
R38 R39 = CMP-03412-030683-1: RES 2.2K OHM 1% 1/5W 0402; Manufacturer Part Number: SR0402FR-7T2K2L; Manufacturer: Yageo; Value: 2.2KΩ; Tolerance: 0.01; Automotive Grade: Grade 0; Power Rating: 0.2W; Voltage Rating: 50V; Device Class L3: Chip SMD Resistors; Category: Res; RoHS: TRUE; Digikey Description: RES 2.2K OHM 1% 1/5W 0402; Ipc Land Pattern Name: RESC10050X35; Height: 0.4mm; Temperature: -55°C to +155°C; Composition: Thick Film; ComponentLink2URL: http://www.yageo.com/documents/recent/PYu-SR_D_F%20tol_RoHS_L_3.pdf; Octopart: https://octopart.com/sr0402fr-7t2k2l-yageo-92673847; Footprint Url: http://www.yageo.com/exep/pages/download/literatures/PYu-R_Mount_10.pdf; Automotive: Yes; Temperature Range High: +155°C; ComponentLink2Description: Datasheet; Device Class L2: Resistors; Resistance: 2.2KΩ; Lead Free: Yes; Series: SR; Device Class L1: Passive Components; Temperature Range Low: -55°C; Package: SR0402
U7 = SHTC3: No Description Available; Mfr_Name: Sensirion; Copyright: Copyright (C) 2022 Ultra Librarian. All rights reserved.; Manufacturer_Part_Number: SHTC3; Digi-Key_Part_Number_1: 1649-1100-1-ND; Digi-Key_Part_Number_2: 1649-1100-2-ND; Digi-Key_Part_Number_3: 1649-1100-6-ND; Digi-Key_Part_Number_4: 1649-1105-1-ND; Digi-Key_Part_Number_5: 1649-1105-2-ND; Digi-Key_Part_Number_6: 1649-1105-6-ND; RefDes: RefDes; Type: DEV

## Sheet Connector_circuit.SchDoc: Printer
size 431 x 279 mm; Date: 2022; Author: Renaissance; CompanyName: Upenn-ESE516; DrawnBy: Xinyang Tan;  Yuxin Wang; Engineer: Xinyang Tan;  Yuxin Wang; Address1: 200 S 33 St; Address2: Moore Building, Rm 101; Address3: Philadephla, PA 19104; DocumentNumber: 5; Revision: 1,0; SheetNumber: 5; SheetTotal: 9
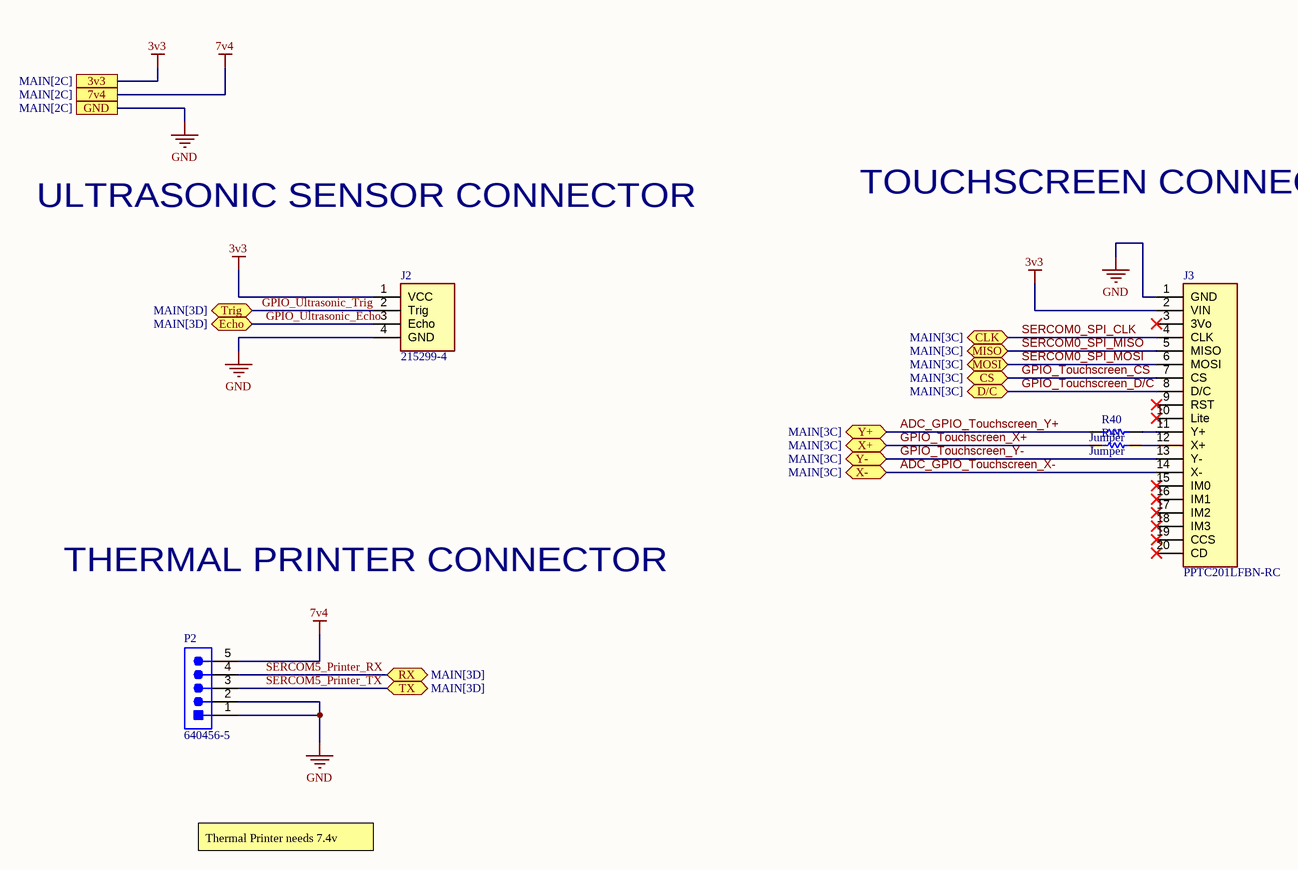
[diagram p5: Connector_circuit.SchDoc]

### Parts
J2  215299-4  [TE_215299-4]
J3  PPTC201LFBN-RC  [RHDR20W75P0X254_1X20_5130X254X850P]
P2  640456-5  [TECO-640456-5]
R40  Jumper  [RESC1609X50X30LL10T20]  (no BOM)
R41  Jumper  [RESC1609X50X30LL10T20]  (no BOM)

### Ports
3v3 (see MAIN[2C]), 7v4 (see MAIN[2C]), CLK (bidir, see MAIN[3C]), CS (bidir, see MAIN[3C]), D/C (bidir, see MAIN[3C]), Echo (bidir, see MAIN[3D]), GND (see MAIN[2C]), MISO (bidir, see MAIN[3C]), MOSI (bidir, see MAIN[3C]), RX (bidir, see MAIN[3D]), Trig (bidir, see MAIN[3D]), TX (bidir, see MAIN[3D]), X+ (bidir, see MAIN[3C]), X- (bidir, see MAIN[3C]), Y+ (bidir, see MAIN[3C]), Y- (bidir, see MAIN[3C])

### Nets
3v3: J2.1(VCC) J3.2(VIN) ; port 3v3
7v4: P2.5(CTS) ; port 7v4
GND: J2.4(GND) J3.1(GND) P2.1(DTR) P2.2(RXI) ; port GND
ADC_GPIO_Touchscreen_X-: J3.14(X-) ; port X-
ADC_GPIO_Touchscreen_Y+: R40.1 ; port Y+
GPIO_Touchscreen_CS: J3.7(CS) ; port CS
GPIO_Touchscreen_D/C: J3.8(D/C) ; port D/C
GPIO_Touchscreen_X+: R41.1 ; port X+
GPIO_Touchscreen_Y-: J3.13(Y-) ; port Y-
GPIO_Ultrasonic_Echo: J2.3(Echo) ; port Echo
GPIO_Ultrasonic_Trig: J2.2(Trig) ; port Trig
SERCOM0_SPI_CLK: J3.4(CLK) ; port CLK
SERCOM0_SPI_MISO: J3.5(MISO) ; port MISO
SERCOM0_SPI_MOSI: J3.6(MOSI) ; port MOSI
SERCOM5_Printer_RX: P2.4(VCC) ; port RX
SERCOM5_Printer_TX: P2.3(TXO) ; port TX
NetJ3_11: J3.11(Y+) R40.2
NetJ3_12: J3.12(X+) R41.2

Not connected (* = marked no-connect by the designer): J3 3(3Vo)* 9(RST)* 10(Lite)* 15(IM0)* 16(IM1)* 17(IM2)* 18(IM3)* 19(CCS)* 20(CD)*

### Notes on the sheet
- ULTRASONIC SENSOR CONNECTOR
- TOUCHSCREEN CONNECTOR
- THERMAL PRINTER CONNECTOR
- Thermal Printer needs 7.4v
- DWG. NO.
- REV.
- SHT.
- THIS DOCUMENT AND THE DATA DISCLOSED HEREIN OR HEREWITH IS THE PROPERTY OF ALTIUM LIMITED AND MAY BE FREELY DISTRIBUTED IN WHOLE. NO RIGHTS ARE RESERVED OR EXPRESS OR IMPLIED WARANTEE GIVEN.
- REVISION
- DESCRIPTION
- DATE
- APPROVED
- ENG:
- APPROVALS
- PROJECT
- DSN:
- CHK:
- REFERENCE DOCUMENTS
- PROJECT REVISION:
- TITLE
- DOCUMENT REVISION:
- DESIGN ITEM:
- BOM:
- FAB DWG:
- PCB DWG:
- ASSY DWG:
- SCALE:
- SIZE
- B
- CAGE CODE
- FILE NAME
- DWG NO.
- SHEET
- OF
- REV

### Library data of the parts
J2 = 215299-4: Connector; Package: None; Price: None; Value: *; MP: 215299-4; Availability: Unavailable
J3 = PPTC201LFBN-RC: Connector; Manufacturer_Name: Sullins; Datasheet Link: https://media.digikey.com/pdf/Data%20Sheets/Sullins%20PDFs/Female_Headers.100_DS.pdf; Height: 8.5mm; Manufacturer_Part_Number: PPTC201LFBN-RC
P2 = CMP-1684-00014-1: Male Header, Pitch 2.54 mm, 1 x 5 Position, Height 10.03 mm, Tail Length 3.56 mm, / -55 to 105 degC, RoHS, Bulk; Manufacturer: TE Connectivity; Material, Housing: Polyester; Brand/Series: MTA-100Series; Color, Housing: White; Current, Rating: 5 / A; Temperature, Operating: -55to+105 / °C; Connector Type: MTA-100; Agency Approvals: CSA,UL; Material, Contact: CopperAlloy; Mounting Hole Size: 0.04 / "; Voltage, Rating: 250 / V; Contact Termination Area Plating: Tin; Pin Spacing: 0.1 / "; Primary Type: InterconnectSystem; Special Features: Pinstrip; Mount Angle: Vertical; Contact Centerline Spacing: 0.100 / in.; Number of Contacts: 5; Standards: RoHSCompliant,ELVCompliant,UL94V-0; Angle: Straight; Length, Terminal Post: 0.14 / in.; Manufacturer URL: http://www.te.com; Flammability Rating: UL94V-0; Mounting Type: PCMount; Termination: Solder; Package Reference: THD; Length, Overall: 0.5 / "; Contact Mating Area Plating: Tin; Length, Pin: 0.14 / "; Datasheet URL: http://sigma.octopart.com/77881742/technical_drawing/TE-Connectivity-640456-5.pdf; Package Description: Male Header, Pitch 2.54 mm, 1 x 5 Position, Height 10.03 mm, Tail Length 3.56 mm; Datasheet Version: Rev. W3; Contact Plating: Tin; Color: White; Number of Positions: 5; Type: PCBPlug; Contact Shape: Square; Number of Rows: 1; Size, Post: 0.025 / in.
R40 R41 = CMP-1012-00001-2: as R6 on sheet MAIN

## Sheet LiPo_Charger.SchDoc: Printer
size 431 x 279 mm; Date: 2022; Author: Renaissance; CompanyName: Upenn-ESE516; DrawnBy: Xinyang Tan;  Yuxin Wang; Engineer: Xinyang Tan;  Yuxin Wang; Address1: 200 S 33 St; Address2: Moore Building, Rm 101; Address3: Philadephla, PA 19104; DocumentNumber: 4; Revision: 1.0; SheetNumber: 4; SheetTotal: 9
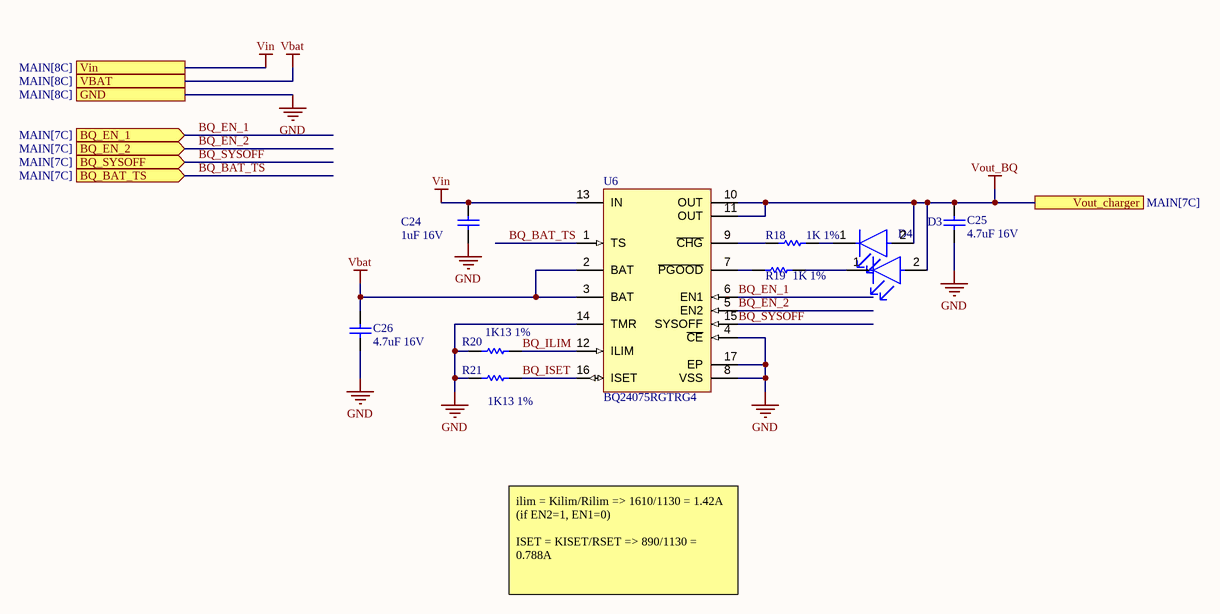
[diagram p6: LiPo_Charger.SchDoc]

### Parts
C24  1uF 16V  [CAPC1608X90X35NL15T15]
C25  4.7uF 16V  [CAPC0805(2012)145_N]
C26  4.7uF 16V  [CAPC0805(2012)145_N]
D3  LTST-C170CKT  [FP-LTST-C170CKT-MFG]  (value not drawn)
D4  LTST-C170GKT  [FP-LTST-C170GKT-MFG]  (value not drawn)
R18  1K 1%  [RESC1609X50X30NL10T20]
R19  1K 1%  [RESC1609X50X30NL10T20]
R20  1K13 1%  [RESC0603(1608)_N]
R21  1K13 1%  [RESC0603(1608)_N]
U6  BQ24075RGTRG4  [RGT16-1700X1700TP]

### Ports
BQ_BAT_TS (in, see MAIN[7C]), BQ_EN_1 (in, see MAIN[7C]), BQ_EN_2 (in, see MAIN[7C]), BQ_SYSOFF (in, see MAIN[7C]), GND (see MAIN[8C]), VBAT (see MAIN[8C]), Vin (see MAIN[8C]), Vout_charger (see MAIN[7C])

### Nets
GND: C24.1 C25.1 C26.2 R20.1 R21.1 U6.4(~{CE}) U6.5(EN2) U6.8(VSS) U6.14(TMR) U6.15(SYSOFF) U6.17(EP) ; port BQ_EN_2, port BQ_SYSOFF, port GND  [also labelled BQ_EN_2, BQ_SYSOFF]
VBAT: C26.1 U6.2(BAT) U6.3(BAT) ; port VBAT
Vin: C24.2 U6.13(IN) ; port Vin  [project net VUSB]
Vout_BQ: C25.2 D3.2(A) D4.2(A) U6.6(EN1) U6.10(OUT) U6.11(OUT) ; port BQ_EN_1, port Vout_charger  [also labelled BQ_EN_1]
BQ_BAT_TS: U6.1(TS) ; port BQ_BAT_TS
BQ_ILIM: R20.2 U6.12(ILIM)  [project net BQ_ILIM_4]
BQ_ISET: R21.2 U6.16(ISET)  [project net BQ_ISET_4]
NetD3_1: D3.1(C) R18.2
NetD4_1: D4.1(C) R19.2
NetR18_1: R18.1 U6.9(~{CHG})
NetR19_1: R19.1 U6.7(~{PGOOD})

### Notes on the sheet
- ilim = Kilim/Rilim => 1610/1130 = 1.42A (if EN2=1, EN1=0)
  ISET = KISET/RSET => 890/1130 = 0.788A
- DWG. NO.
- REV.
- SHT.
- THIS DOCUMENT AND THE DATA DISCLOSED HEREIN OR HEREWITH IS THE PROPERTY OF ALTIUM LIMITED AND MAY BE FREELY DISTRIBUTED IN WHOLE. NO RIGHTS ARE RESERVED OR EXPRESS OR IMPLIED WARANTEE GIVEN.
- REVISION
- DESCRIPTION
- DATE
- APPROVED
- ENG:
- APPROVALS
- PROJECT
- DSN:
- CHK:
- REFERENCE DOCUMENTS
- PROJECT REVISION:
- TITLE
- DOCUMENT REVISION:
- DESIGN ITEM:
- BOM:
- FAB DWG:
- PCB DWG:
- ASSY DWG:
- SCALE:
- SIZE
- B
- CAGE CODE
- FILE NAME
- DWG NO.
- SHEET
- OF
- REV

### Library data of the parts
C24 = CMP-1035-02736-2: Manufacturer: AVX Interconnect / Elco; Part Number: 0603YC105JAT2A
C25 C26 = CMP-1036-04893-1: as C4 on sheet FTDI; Max Thickness: 1.45 mm; Value: 4.7uF; Rated Voltage: 16 V; Tolerance: -20% to +80%; Technology: SMT
D3 = CMP-1674-00001-6: as D5 on sheet FTDI; Package Quantity: 1; Packaging: Tape and Reel; Max Operating Temperature: 85°C; Min Operating Temperature: -55°C; Mount: Surface Mount; Length: 2mm; Height: 1.1mm; Case/Package: 0805; Radiation Hardening: No; Illumination Color: Red; Max Power Dissipation: 100mW; Reverse Voltage: 5V; Lead Free: Lead Free; Color: Red; Case Code (Imperial): 0805; Case Code (Metric): 2012; Power Rating: 100mW; Lens Transparency: Clear; Number of LEDs: 1; Number of Pins: 2; Depth: 1.25mm; Width: 1.25mm
D4 = CMP-1674-00002-6: LED GREEN CLEAR SMD; Dominant Wavelength: 569nm; Lens Style: Diffused; Forward Voltage: 2.1V; Number of Elements: 1; Wavelength: 565nm; Luminous Intensity: 6mcd; Test Current: 10mA; Power Dissipation: 100mW; Reverse Voltage: 5V; Forward Current: 30mA; Viewing Angle: 130°; Lens Color: Colorless; Height: 1.1mm; Package Quantity: 1; Packaging: Tape and Reel; Mount: Surface Mount; Min Operating Temperature: -55°C; Max Operating Temperature: 85°C; Length: 2mm; Number of Pins: 2; Color: Green; Radiation Hardening: No; Illumination Color: Green; Case Code (Metric): 2012; Lens Transparency: Clear; Case/Package: 0805; Width: 1.25mm; Case Code (Imperial): 0805; Depth: 1.25mm; Power Rating: 100mW; Lead Free: Lead Free; Number of LEDs: 1; Voltage: 5V
R18 R19 = CMP-1012-00510-2: as R7 on sheet MAIN
R20 R21 = CMP-1012-00515-1: 1K13 0.1W 1% 0603 (1608 Metric)  SMD; Value: 1130.00 Ohm; Case-EIA: 0603; Case-Metric: 1608; Power: 0.1 W; Tolerance: 1 %; Technology: SMT
U6 = CMP-0321-00237-1: USB-Friendly Li-Ion Battery Charger and Power-Path Management IC, Vout 5.5 V, 4.3 V, -40 to 85 degC, 16-pin QFN (RGT), Green (RoHS & no Sb/Br); Manufacturer: Texas Instruments; Li-Ion: N; SubFamily: Battery Charge Management; Vin(Min)(V): 4.3; ComponentLink1URL: http://www.ti.com/general/docs/lit/getliterature.tsp?genericPartNumber=BQ24075&fileType=pdf; Over Voltage Protection: N; PackageDescription: 16-Pin Plastic Quad Flat No-Lead, 3 x 3 mm Body, 0.5 mm Pitch, 1.7 x 1.7 mm Exposed Pad; NiMH: N; Li-Polymer: N; Eco-Plan: Green (RoHS & no Sb/Br); Code_JEDEC: MO-220; Lead Acid: N; PartNumber: BQ24075RGTRG4; ComponentLink1Description: Datasheet; Mounting Technology: Surface Mount; PackageVersion: revH, Oct-2011; PackageReference: RGT16-1700X1700TP; NiCd: N; DatasheetVersion: SLUS810G